# Altium project oai_kpa_mku.PrjPcb (part 1 of 2)
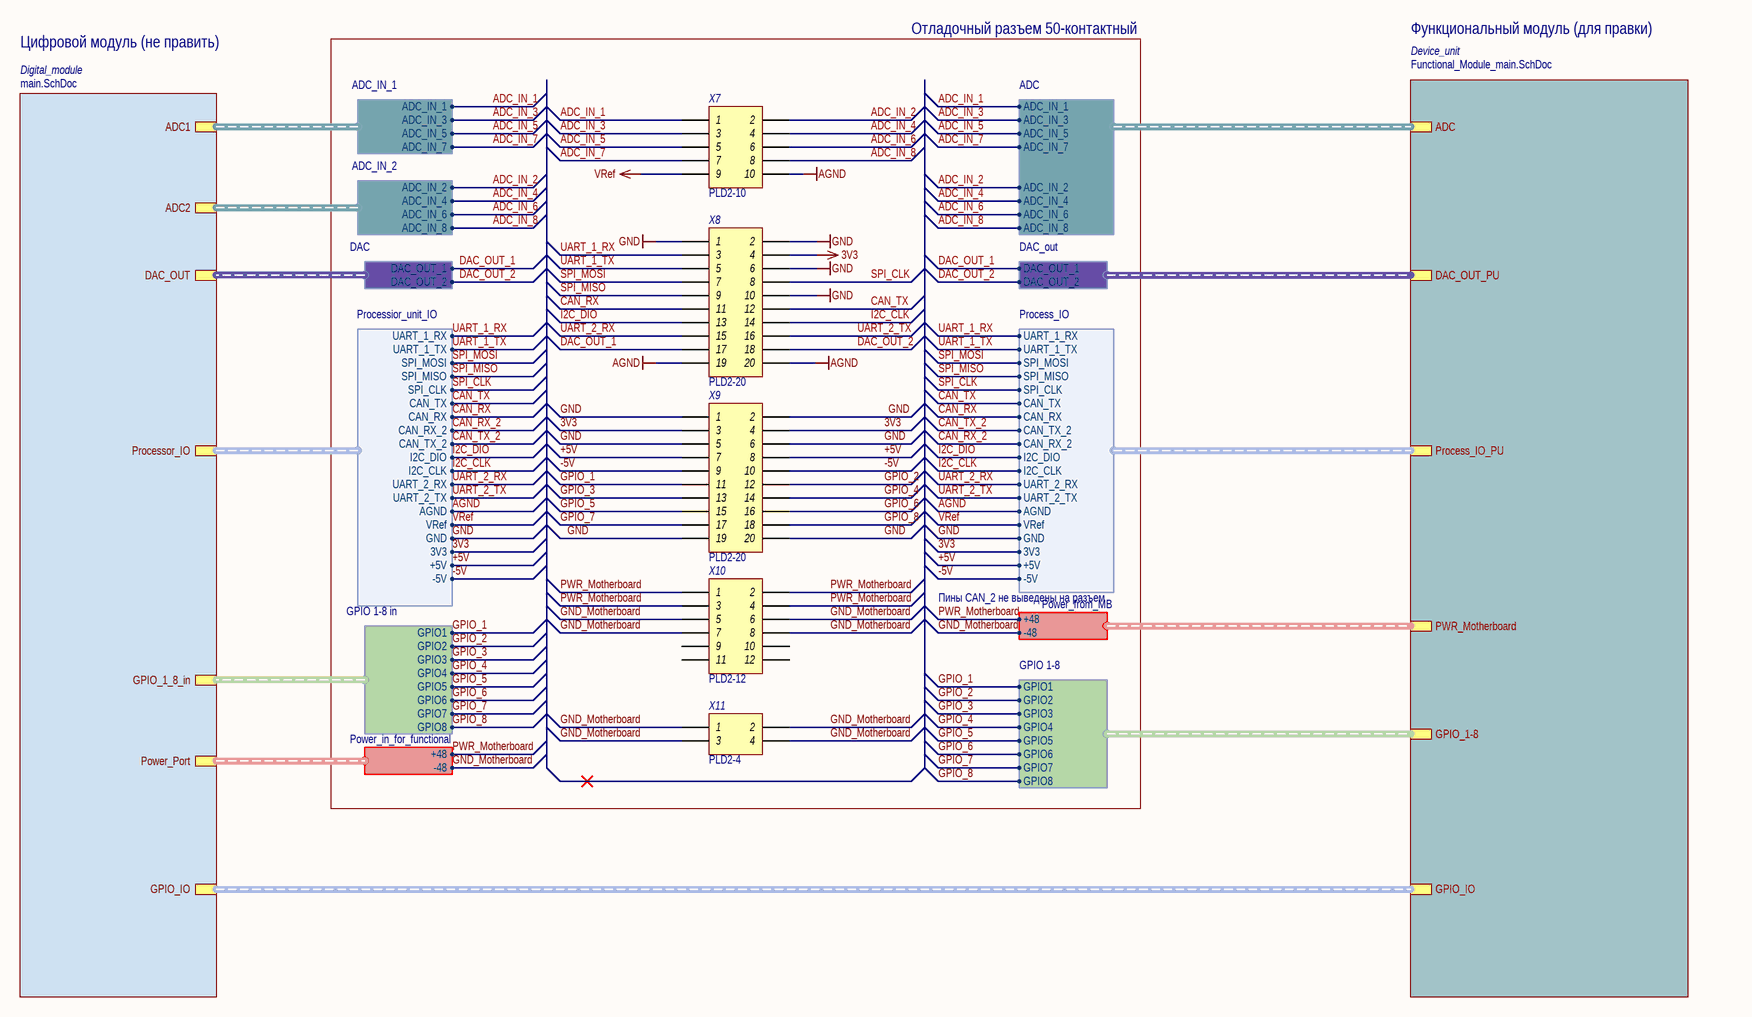
[diagram p0: Module_main.SchDoc]
GlobalFunctionalModuleName: ОАИ КПА УЦМ; GlobalFunctionalModuleRevision: #3.0; GlobalProjectName: OAI_KPA_MKU; GlobalProjectNumber: ЮМП.250.; GlobalProjectRevision: #2.2; Наименование: ОАИ КПА МКУ Модуль; Норм.Контр.: Задорожная; Проверил: Прокопьев; Разработал: Стюф; Утвердил: Прокопьев
10 sheets, 177 parts. Net scope: hierarchical (ports join the sheet entries above them; power ports are global).
Board file: oai_kpa_mku.PcbDoc
Sheets:
  Module_main.SchDoc
    Digital_module = main.SchDoc
      USB = USB.SchDoc
      ADC_Filter = adc.SchDoc
      DAC_Filter = dac.SchDoc
      Designator = GPIO_Shunt.SchDoc
      Power = power.SchDoc
    Device_unit = Functional_Module_main.SchDoc
      mku_0 = mku_16_ch.SchDoc
        opt_0 = optron_ku_2ch.SchDoc
        opt_1 = optron_ku_2ch.SchDoc
        opt_2 = optron_ku_2ch.SchDoc
        opt_3 = optron_ku_2ch.SchDoc
        opt_4 = optron_ku_2ch.SchDoc
        opt_5 = optron_ku_2ch.SchDoc
        opt_6 = optron_ku_2ch.SchDoc
        opt_7 = optron_ku_2ch.SchDoc

## Sheet Module_main.SchDoc: =GlobalProjectName
size 410 x 297 mm; ApprovedBy: Прокопьев; CheckedBy: Прокопьев; Author: Стюф; DocumentNumber: ЮМП.250. Э3; Revision: #2.2; SheetNumber: 7; SheetTotal: 9; PageSetup: Record=PageOptions|CenterHorizontal=True|CenterVertical=True|PrintScale=1.00|XCorrection=1.00|YCorrection=1.00|PrintKind=1|BorderSize=5000000|LeftOffset=0|BottomOffset=0|Orientation=2|PaperLength=1000|PaperWidth=1000|Scale=100|PaperSource=15|PrintQuality=1200|MediaType=1|DitherType=10|PaperKind=A3|PrintScaleMode=1; Weight: -; ScaleFactor: -; NormInspection: Задорожная; FirstApplication: ЮМП.250.; DocumentName: OAI_KPA_MKU

### Parts
X7  Header 2X10  [PBD2-10s]  (value not drawn)
X8  Header 2X10  [PBD2-20s]  (value not drawn)
X9  Header 2X10  [PBD2-20s]  (value not drawn)
X10  Header 2X6  [PLD2-12R 2.54]  (value not drawn)
X11  Header 2X4  [PLD2-4 R 2.54]  (value not drawn)

### Sub-sheets
Device_unit = Functional_Module_main.SchDoc: GPIO_1-8 (harness GPIO 1-8), Process_IO_PU (harness Process_IO), DAC_OUT_PU (harness DAC_out), ADC (harness ADC), PWR_Motherboard (harness Power_from_MB), GPIO_IO (harness GPIO)
Digital_module = main.SchDoc: ADC2 (harness ADC_IN_2), DAC_OUT (harness DAC), Processor_IO (harness Processior_unit_IO), ADC1 (harness ADC_IN_1), Power_Port (harness Power_in_for_functional), GPIO_IO (harness GPIO), GPIO_1_8_in (harness GPIO 1-8 in)

### Harnesses
ADC_IN_1: ADC_IN_1, ADC_IN_3, ADC_IN_7, ADC_IN_5
ADC_IN_2: ADC_IN_8, ADC_IN_6, ADC_IN_4, ADC_IN_2
Processior_unit_IO: UART_1_RX, UART_1_TX, SPI_MOSI, SPI_MISO, SPI_CLK, CAN_TX, CAN_RX, I2C_DIO, I2C_CLK, UART_2_RX, UART_2_TX, AGND, VRef, GND, 3V3, +5V, -5V, CAN_RX_2, CAN_TX_2
DAC: DAC_OUT_1, DAC_OUT_2
GPIO 1-8 in: GPIO1, GPIO2, GPIO3, GPIO4, GPIO5, GPIO6, GPIO7, GPIO8
Process_IO: UART_1_RX, UART_1_TX, SPI_MOSI, SPI_MISO, SPI_CLK, CAN_TX, CAN_RX, I2C_DIO, I2C_CLK, UART_2_RX, UART_2_TX, AGND, VRef, GND, 3V3, +5V, -5V, CAN_TX_2, CAN_RX_2
ADC: ADC_IN_1, ADC_IN_3, ADC_IN_7, ADC_IN_5, ADC_IN_2, ADC_IN_4, ADC_IN_6, ADC_IN_8
DAC_out: DAC_OUT_1, DAC_OUT_2
GPIO 1-8: GPIO1, GPIO2, GPIO3, GPIO4, GPIO5, GPIO6, GPIO7, GPIO8
Power_in_for_functional: +48, -48
Power_from_MB: -48, +48

### Nets
3V3: X8.4 X9.3 X9.4 ; sheet Digital_module/Processor_IO.3V3, sheet Device_unit/Process_IO_PU.3V3  [project net 3.3V]
+5V: X9.7 X9.8 ; sheet Digital_module/Processor_IO.+5V, sheet Device_unit/Process_IO_PU.+5V
-5V: X9.9 X9.10 ; sheet Digital_module/Processor_IO.-5V, sheet Device_unit/Process_IO_PU.-5V
AGND: X7.10 X8.19 X8.20 ; sheet Digital_module/Processor_IO.AGND, sheet Device_unit/Process_IO_PU.AGND  [project net A_GND]
GND: X8.1 X8.2 X8.6 X8.10 X9.1 X9.2 X9.5 X9.6 X9.19 X9.20 ; sheet Digital_module/Processor_IO.GND, sheet Device_unit/Process_IO_PU.GND
GND_Motherboard: X10.5 X10.6 X10.7 X10.8 X11.1 X11.2 X11.3 X11.4 ; sheet Digital_module/Power_Port.-48, sheet Device_unit/PWR_Motherboard.-48  [project net GND_IN]
PWR_Motherboard: X10.1 X10.2 X10.3 X10.4 ; sheet Digital_module/Power_Port.+48, sheet Device_unit/PWR_Motherboard.+48  [project net Power_IN]
VRef: X7.9 ; sheet Digital_module/Processor_IO.VRef, sheet Device_unit/Process_IO_PU.VRef  [project net 2V048]
ADC_IN_1: X7.1 ; sheet Digital_module/ADC1.ADC_IN_1, sheet Device_unit/ADC.ADC_IN_1
ADC_IN_2: X7.2 ; sheet Digital_module/ADC2.ADC_IN_2, sheet Device_unit/ADC.ADC_IN_2
ADC_IN_3: X7.3 ; sheet Digital_module/ADC1.ADC_IN_3, sheet Device_unit/ADC.ADC_IN_3
ADC_IN_4: X7.4 ; sheet Digital_module/ADC2.ADC_IN_4, sheet Device_unit/ADC.ADC_IN_4
ADC_IN_5: X7.5 ; sheet Digital_module/ADC1.ADC_IN_5, sheet Device_unit/ADC.ADC_IN_5
ADC_IN_6: X7.6 ; sheet Digital_module/ADC2.ADC_IN_6, sheet Device_unit/ADC.ADC_IN_6
ADC_IN_7: X7.7 ; sheet Digital_module/ADC1.ADC_IN_7, sheet Device_unit/ADC.ADC_IN_7
ADC_IN_8: X7.8 ; sheet Digital_module/ADC2.ADC_IN_8, sheet Device_unit/ADC.ADC_IN_8
CAN_RX: X8.11 ; sheet Digital_module/Processor_IO.CAN_RX, sheet Device_unit/Process_IO_PU.CAN_RX
CAN_RX_2: sheet Digital_module/Processor_IO.CAN_RX_2, sheet Device_unit/Process_IO_PU.CAN_RX_2
CAN_TX: X8.12 ; sheet Digital_module/Processor_IO.CAN_TX, sheet Device_unit/Process_IO_PU.CAN_TX
CAN_TX_2: sheet Digital_module/Processor_IO.CAN_TX_2, sheet Device_unit/Process_IO_PU.CAN_TX_2
DAC_OUT_1: X8.17 ; sheet Digital_module/DAC_OUT.DAC_OUT_1, sheet Device_unit/DAC_OUT_PU.DAC_OUT_1
DAC_OUT_2: X8.18 ; sheet Digital_module/DAC_OUT.DAC_OUT_2, sheet Device_unit/DAC_OUT_PU.DAC_OUT_2
GPIO_1: X9.11 ; sheet Digital_module/GPIO_1_8_in.GPIO1, sheet Device_unit/GPIO_1-8.GPIO1
GPIO_2: X9.12 ; sheet Digital_module/GPIO_1_8_in.GPIO2, sheet Device_unit/GPIO_1-8.GPIO2
GPIO_3: X9.13 ; sheet Digital_module/GPIO_1_8_in.GPIO3, sheet Device_unit/GPIO_1-8.GPIO3
GPIO_4: X9.14 ; sheet Digital_module/GPIO_1_8_in.GPIO4, sheet Device_unit/GPIO_1-8.GPIO4
GPIO_5: X9.15 ; sheet Digital_module/GPIO_1_8_in.GPIO5, sheet Device_unit/GPIO_1-8.GPIO5
GPIO_6: X9.16 ; sheet Digital_module/GPIO_1_8_in.GPIO6, sheet Device_unit/GPIO_1-8.GPIO6
GPIO_7: X9.17 ; sheet Digital_module/GPIO_1_8_in.GPIO7, sheet Device_unit/GPIO_1-8.GPIO7
GPIO_8: X9.18 ; sheet Digital_module/GPIO_1_8_in.GPIO8, sheet Device_unit/GPIO_1-8.GPIO8
I2C_CLK: X8.14 ; sheet Digital_module/Processor_IO.I2C_CLK, sheet Device_unit/Process_IO_PU.I2C_CLK
I2C_DIO: X8.13 ; sheet Digital_module/Processor_IO.I2C_DIO, sheet Device_unit/Process_IO_PU.I2C_DIO
SPI_CLK: X8.8 ; sheet Digital_module/Processor_IO.SPI_CLK, sheet Device_unit/Process_IO_PU.SPI_CLK
SPI_MISO: X8.9 ; sheet Digital_module/Processor_IO.SPI_MISO, sheet Device_unit/Process_IO_PU.SPI_MISO
SPI_MOSI: X8.7 ; sheet Digital_module/Processor_IO.SPI_MOSI, sheet Device_unit/Process_IO_PU.SPI_MOSI
UART_1_RX: X8.3 ; sheet Digital_module/Processor_IO.UART_1_RX, sheet Device_unit/Process_IO_PU.UART_1_RX
UART_1_TX: X8.5 ; sheet Digital_module/Processor_IO.UART_1_TX, sheet Device_unit/Process_IO_PU.UART_1_TX
UART_2_RX: X8.15 ; sheet Digital_module/Processor_IO.UART_2_RX, sheet Device_unit/Process_IO_PU.UART_2_RX
UART_2_TX: X8.16 ; sheet Digital_module/Processor_IO.UART_2_TX, sheet Device_unit/Process_IO_PU.UART_2_TX

Not connected (* = marked no-connect by the designer): X10 9 10 11 12

### Buses and harness runs
harness sheet Device_unit/GPIO_IO = sheet Digital_module/GPIO_IO

### Notes on the sheet
- Цифровой модуль (не править)
- Отладочный разъем 50-контактный
- Функциональный модуль (для правки)
- Пины CAN_2 не выведены на разъем
- Перв. примен.
- Справ. №
- Подп. и дата
- Инв. № дубл.
- Взам. инв. №
- Изм.
- Разраб.
- Лист
- № докум.
- Подп.
- Дата
- Литера
- Масса
- Масштаб
- Пров.
- Т.контр.
- Листов
- Н.контр.
- Утв.
- Инв. № подл.
- Форма 1 ГОСТ 2.104-2006
- Копировал
- Формат А3

### Library data of the parts
X7 = PLD2-10: Header, 10-Pin, Dual row; Потребление, Вт: 0,0; Назначение: Header, 10-Pin, Dual row; Наименование: PLD2-10
X8 X9 = PLD2-20: Header, 12-Pin, Dual row; Назначение: Header, 20-Pin, Dual row; Потребление, Вт: 0,0; Наименование: PLD2-20
X10 = PLD2-12: Header, 12-Pin, Dual row; Потребление, Вт: 0,0; Назначение: Header, 12-Pin, Dual row; Наименование: PLD2-12
X11 = PLD2-4: Header, 4-Pin, Dual row; Потребление, Вт: 0,0; Назначение: Header, 4-Pin, Dual row; Наименование: PLD2-4

## Sheet main.SchDoc: =GlobalProjectName
size 410 x 297 mm; ApprovedBy: Утвердил; CheckedBy: Проверил; Author: Разработал; DocumentNumber: ЮМП.250. Э3; Revision: #2.2; SheetNumber: 3; SheetTotal: 9; PageSetup: Record=PageOptions|CenterHorizontal=True|CenterVertical=True|PrintScale=1.00|XCorrection=1.00|YCorrection=1.00|PrintKind=1|BorderSize=5000000|LeftOffset=0|BottomOffset=0|Orientation=2|PaperLength=1000|PaperWidth=1000|Scale=100|PaperSource=15|PrintQuality=1200|MediaType=1|DitherType=10|PaperKind=A3|PrintScaleMode=1; Weight: -; ScaleFactor: -; NormInspection: Норм.Контр.; FirstApplication: ЮМП.250.; Time: Листов; DocumentName: OAI_KPA_MKU
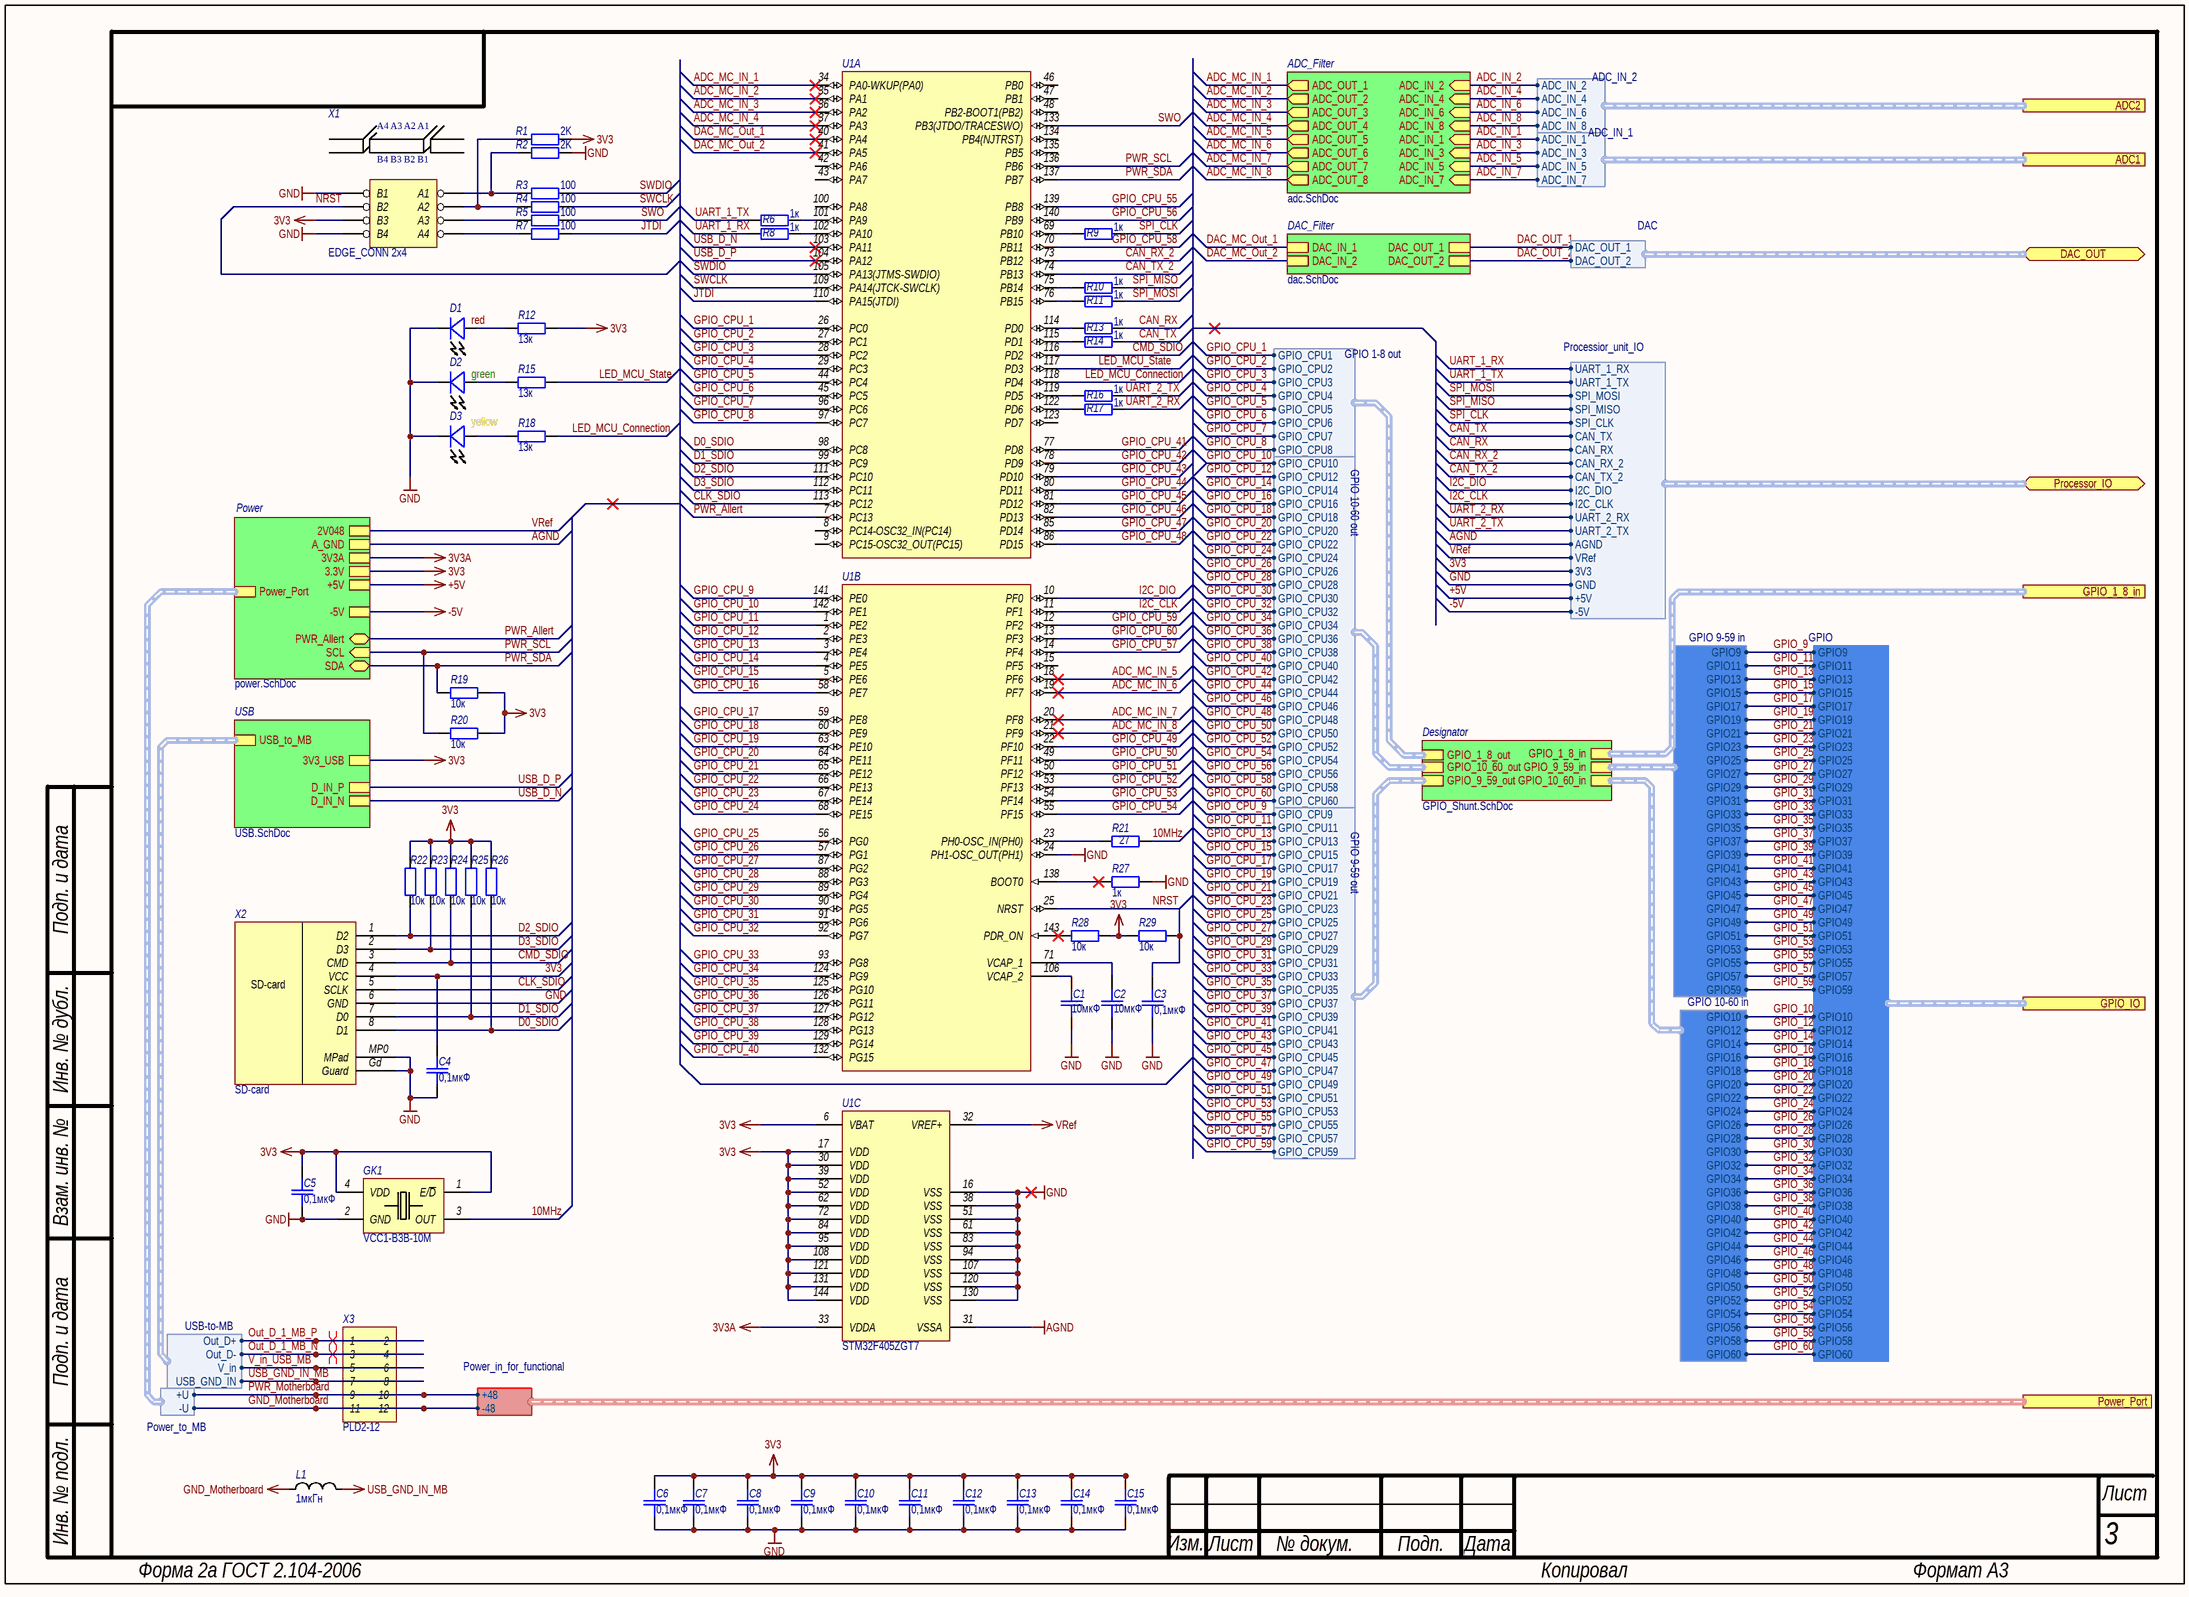
[diagram p1: main.SchDoc]

### Parts
C1  10мкФ  [SMD_0805]
C2  10мкФ  [SMD_0805]
C3  0,1мкФ  [SMD_0805]
C4  0,1мкФ  [SMD_0805]
C5  0,1мкФ  [SMD_0805]
C6  0,1мкФ  [SMD_0805]
C7  0,1мкФ  [SMD_0805]
C8  0,1мкФ  [SMD_0805]
C9  0,1мкФ  [SMD_0805]
C10  0,1мкФ  [SMD_0805]
C11  0,1мкФ  [SMD_0805]
C12  0,1мкФ  [SMD_0805]
C13  0,1мкФ  [SMD_0805]
C14  0,1мкФ  [SMD_0805]
C15  0,1мкФ  [SMD_0805]
D1  value red  [LED-0805]  (hidden comment: LED)
D2  value green  [LED-0805]  (hidden comment: LED)
D3  value yellow  [LED-0805]  (hidden comment: LED)
GK1  Наименование: VCC1-B3B-10M  [SMD_7050_Crystal_Oscillator]  (hidden comment: GK108-P)
L1  1мкГн  [SMD_0805]
R1  2K  [SMD_0603]
R2  2K  [SMD_0603]
R3  100  [SMD_0603]
R4  100  [SMD_0603]
R5  100  [SMD_0603]
R6  1к  [SMD_0603]
R7  100  [SMD_0603]
R8  1к  [SMD_0603]
R9  1к  [SMD_0603]
R10  1к  [SMD_0603]
R11  1к  [SMD_0603]
R12  13к  [SMD_0603]
R13  1к  [SMD_0603]
R14  1к  [SMD_0603]
R15  13к  [SMD_0603]
R16  1к  [SMD_0603]
R17  1к  [SMD_0603]
R18  13к  [SMD_0603]
R19  10к  [SMD_0603]
R20  10к  [SMD_0603]
R21  27  [SMD_0603]
R22  10к  [SMD_0603]
R23  10к  [SMD_0603]
R24  10к  [SMD_0603]
R25  10к  [SMD_0603]
R26  10к  [SMD_0603]
R27  1к  [SMD_0603]
R28  10к  [SMD_0603]
R29  10к  [SMD_0603]
U1  STM32F405ZGT7  [LQFP144]  (value not drawn)  (parts A,B,C of 3)
X1  EDGE_CONN 2x4  [EDGE_CON-8]
X2  SD-card  [SD-card holder]
X3  Header 2X6  [PLD2-12R 2.54]  (value not drawn)

### Sub-sheets
ADC_Filter = adc.SchDoc: ADC_OUT_4 (out), ADC_IN_7 (in), ADC_OUT_3 (out), ADC_IN_4 (in), ADC_IN_2 (in), ADC_IN_3 (in), ADC_IN_1 (in), ADC_IN_8 (in), ADC_IN_5 (in), ADC_OUT_7 (out), ADC_OUT_1 (out), ADC_OUT_6 (out), ADC_IN_6 (in), ADC_OUT_5 (out), ADC_OUT_2 (out), ADC_OUT_8 (out)
DAC_Filter = dac.SchDoc: DAC_IN_1, DAC_OUT_1, DAC_IN_2, DAC_OUT_2
Designator = GPIO_Shunt.SchDoc: GPIO_10_60_out (harness GPIO 10-60 out), GPIO_10_60_in (harness GPIO 10-60 in), GPIO_9_59_out (harness GPIO 9-59 out), GPIO_9_59_in (harness GPIO 9-59 in), GPIO_1_8_out (harness GPIO 1-8 out), GPIO_1_8_in (harness GPIO 1-8 in)
Power = power.SchDoc: 3.3V, PWR_Allert (bidir), +5V, SCL (in), SDA (bidir), -5V, 2V048, A_GND, Power_Port (harness Power_to_MB), 3V3A
USB = USB.SchDoc: USB_to_MB (harness USB-to-MB), 3V3_USB, D_IN_P, D_IN_N

### Ports
ADC1 (harness ADC_IN_1), ADC2 (harness ADC_IN_2), DAC_OUT (bidir, harness DAC), GPIO_1_8_in (harness GPIO 10-60 in), GPIO_IO (harness GPIO), Power_Port (harness Power_in_for_functional), Processor_IO (bidir, harness Processior_unit_IO)

### Harnesses
ADC_IN_2: ADC_IN_2, ADC_IN_4, ADC_IN_6, ADC_IN_8
ADC_IN_1: ADC_IN_3, ADC_IN_1, ADC_IN_5, ADC_IN_7
GPIO 1-8 out: GPIO_CPU2, GPIO_CPU3, GPIO_CPU4, GPIO_CPU5, GPIO_CPU6, GPIO_CPU7, GPIO_CPU8, GPIO_CPU1
GPIO 10-60 out: GPIO_CPU12, GPIO_CPU10, GPIO_CPU14, GPIO_CPU16, GPIO_CPU18, GPIO_CPU20, GPIO_CPU22, GPIO_CPU24, GPIO_CPU26, GPIO_CPU28, GPIO_CPU30, GPIO_CPU32, GPIO_CPU34, GPIO_CPU36, GPIO_CPU38, GPIO_CPU40, GPIO_CPU42, GPIO_CPU44, GPIO_CPU46, GPIO_CPU48, GPIO_CPU50, GPIO_CPU52, GPIO_CPU54, GPIO_CPU56, GPIO_CPU58, GPIO_CPU60
GPIO 9-59 out: GPIO_CPU13, GPIO_CPU11, GPIO_CPU15, GPIO_CPU17, GPIO_CPU19, GPIO_CPU21, GPIO_CPU23, GPIO_CPU25, GPIO_CPU27, GPIO_CPU29, GPIO_CPU31, GPIO_CPU33, GPIO_CPU35, GPIO_CPU37, GPIO_CPU39, GPIO_CPU41, GPIO_CPU43, GPIO_CPU45, GPIO_CPU47, GPIO_CPU49, GPIO_CPU51, GPIO_CPU53, GPIO_CPU55, GPIO_CPU57, GPIO_CPU59, GPIO_CPU9
Power_to_MB: +U, -U
USB-to-MB: V_in, Out_D+, Out_D-, USB_GND_IN
DAC: DAC_OUT_1, DAC_OUT_2
Processior_unit_IO: UART_1_RX, UART_1_TX, SPI_MOSI, SPI_MISO, SPI_CLK, CAN_TX, CAN_RX, I2C_DIO, I2C_CLK, UART_2_RX, UART_2_TX, AGND, VRef, 3V3, GND, +5V, -5V, CAN_RX_2, CAN_TX_2
Power_in_for_functional: +48, -48
GPIO 9-59 in: GPIO9, GPIO11, GPIO13, GPIO15, GPIO17, GPIO19, GPIO21, GPIO23, GPIO25, GPIO27, GPIO29, GPIO31, GPIO33, GPIO35, GPIO37, GPIO39, GPIO41, GPIO43, GPIO45, GPIO47, GPIO49, GPIO51, GPIO53, GPIO55, GPIO57, GPIO59
GPIO 10-60 in: GPIO10, GPIO12, GPIO14, GPIO16, GPIO18, GPIO20, GPIO22, GPIO24, GPIO26, GPIO28, GPIO30, GPIO32, GPIO34, GPIO36, GPIO38, GPIO40, GPIO42, GPIO44, GPIO46, GPIO48, GPIO50, GPIO52, GPIO54, GPIO56, GPIO58, GPIO60
GPIO: GPIO9, GPIO11, GPIO13, GPIO15, GPIO17, GPIO19, GPIO21, GPIO23, GPIO25, GPIO27, GPIO29, GPIO31, GPIO33, GPIO35, GPIO37, GPIO39, GPIO41, GPIO43, GPIO45, GPIO47, GPIO49, GPIO51, GPIO53, GPIO55, GPIO57, GPIO59, GPIO10, GPIO12, GPIO14, GPIO16, GPIO18, GPIO20, GPIO22, GPIO24, GPIO26, GPIO28, GPIO30, GPIO32, GPIO34, GPIO36, GPIO38, GPIO40, GPIO42, GPIO44, GPIO46, GPIO48, GPIO50, GPIO52, GPIO54, GPIO56, GPIO58, GPIO60

### Nets
3V3: C4.2 C5.2 C6.2 C7.2 C8.2 C9.2 C10.2 C11.2 C12.2 C13.2 C14.2 C15.2 GK1.1(E/~{D}) GK1.4(VDD) R1.2 R12.2 R19.2 R20.2 R22.2 R23.2 R24.2 R25.2 R26.2 R28.2 R29.1 U1.6(VBAT) U1.17(VDD) U1.30(VDD) U1.39(VDD) U1.52(VDD) U1.62(VDD) U1.72(VDD) U1.84(VDD) U1.95(VDD) U1.108(VDD) U1.121(VDD) U1.131(VDD) U1.144(VDD) X1.B3 X2.4(VCC) ; sheet USB/3V3_USB, sheet Power/3.3V, port Processor_IO.3V3  [project net 3.3V]
3V3A: U1.33(VDDA) ; sheet Power/3V3A
+5V: sheet Power/+5V, port Processor_IO.+5V
-5V: sheet Power/-5V, port Processor_IO.-5V
AGND: U1.31(VSSA) ; sheet Power/A_GND, port Processor_IO.AGND  [project net A_GND]
GND: C1.1 C2.1 C3.1 C4.1 C5.1 C6.1 C7.1 C8.1 C9.1 C10.1 C11.1 C12.1 C13.1 C14.1 C15.1 D1.2(K) D2.2(K) D3.2(K) GK1.2(GND) R2.2 R27.2 U1.16(VSS) U1.24(PH1-OSC_OUT(PH1)) U1.38(VSS) U1.51(VSS) U1.61(VSS) U1.83(VSS) U1.94(VSS) U1.107(VSS) U1.120(VSS) U1.130(VSS) X1.B1 X1.B4 X2.6(GND) X2.Gd(Guard) X2.MP0(MPad) ; port Processor_IO.GND
GND_Motherboard: L1.1 X3.11 X3.12 ; sheet Power/Power_Port.-U, port Power_Port.-48  [project net GND_IN]
PWR_Motherboard: X3.9 X3.10 ; sheet Power/Power_Port.+U, port Power_Port.+48  [project net Power_IN]
USB_GND_IN_MB: L1.2 X3.7 X3.8 ; sheet USB/USB_to_MB.USB_GND_IN  [project net USB_GND_IN]
VRef: U1.32(VREF+) ; sheet Power/2V048, port Processor_IO.VRef  [project net 2V048]
10MHz: GK1.3(OUT) R21.2
ADC_IN_1: sheet ADC_Filter/ADC_IN_1, port ADC1.ADC_IN_1
ADC_IN_2: sheet ADC_Filter/ADC_IN_2, port ADC2.ADC_IN_2
ADC_IN_3: sheet ADC_Filter/ADC_IN_3, port ADC1.ADC_IN_3
ADC_IN_4: sheet ADC_Filter/ADC_IN_4, port ADC2.ADC_IN_4
ADC_IN_5: sheet ADC_Filter/ADC_IN_5, port ADC1.ADC_IN_5
ADC_IN_6: sheet ADC_Filter/ADC_IN_6, port ADC2.ADC_IN_6
ADC_IN_7: sheet ADC_Filter/ADC_IN_7, port ADC1.ADC_IN_7
ADC_IN_8: sheet ADC_Filter/ADC_IN_8, port ADC2.ADC_IN_8
ADC_MC_IN_1: U1.34(PA0-WKUP(PA0)) ; sheet ADC_Filter/ADC_OUT_1
ADC_MC_IN_2: U1.35(PA1) ; sheet ADC_Filter/ADC_OUT_2
ADC_MC_IN_3: U1.36(PA2) ; sheet ADC_Filter/ADC_OUT_3
ADC_MC_IN_4: U1.37(PA3) ; sheet ADC_Filter/ADC_OUT_4
ADC_MC_IN_5: U1.18(PF6) ; sheet ADC_Filter/ADC_OUT_5
ADC_MC_IN_6: U1.19(PF7) ; sheet ADC_Filter/ADC_OUT_6
ADC_MC_IN_7: U1.20(PF8) ; sheet ADC_Filter/ADC_OUT_7
ADC_MC_IN_8: U1.21(PF9) ; sheet ADC_Filter/ADC_OUT_8
CAN_RX: R13.2 ; port Processor_IO.CAN_RX
CAN_RX_2: U1.73(PB12) ; port Processor_IO.CAN_RX_2
CAN_TX: R14.2 ; port Processor_IO.CAN_TX
CAN_TX_2: U1.74(PB13) ; port Processor_IO.CAN_TX_2
CLK_SDIO: U1.113(PC12) X2.5(SCLK)
CMD_SDIO: R24.1 U1.116(PD2) X2.3(CMD)
D0_SDIO: R26.1 U1.98(PC8) X2.8(D1)
D1_SDIO: R25.1 U1.99(PC9) X2.7(D0)
D2_SDIO: R22.1 U1.111(PC10) X2.1(D2)
D3_SDIO: R23.1 U1.112(PC11) X2.2(D3)
DAC_MC_Out_1: U1.40(PA4) ; sheet DAC_Filter/DAC_IN_1
DAC_MC_Out_2: U1.41(PA5) ; sheet DAC_Filter/DAC_IN_2
DAC_OUT_1: sheet DAC_Filter/DAC_OUT_1, port DAC_OUT.DAC_OUT_1
DAC_OUT_2: sheet DAC_Filter/DAC_OUT_2, port DAC_OUT.DAC_OUT_2
GPIO_9: U1.141(PE0) ; sheet Designator/GPIO_9_59_out.GPIO_CPU9, sheet Designator/GPIO_9_59_in.GPIO9, port GPIO_IO.GPIO9  [also labelled GPIO_CPU_9]
GPIO_10: U1.142(PE1) ; sheet Designator/GPIO_10_60_out.GPIO_CPU10, sheet Designator/GPIO_10_60_in.GPIO10, port GPIO_IO.GPIO10  [also labelled GPIO_CPU_10]
GPIO_11: U1.1(PE2) ; sheet Designator/GPIO_9_59_out.GPIO_CPU11, sheet Designator/GPIO_9_59_in.GPIO11, port GPIO_IO.GPIO11  [also labelled GPIO_CPU_11]
GPIO_12: U1.2(PE3) ; sheet Designator/GPIO_10_60_out.GPIO_CPU12, sheet Designator/GPIO_10_60_in.GPIO12, port GPIO_IO.GPIO12  [also labelled GPIO_CPU_12]
GPIO_13: U1.3(PE4) ; sheet Designator/GPIO_9_59_out.GPIO_CPU13, sheet Designator/GPIO_9_59_in.GPIO13, port GPIO_IO.GPIO13  [also labelled GPIO_CPU_13]
GPIO_14: U1.4(PE5) ; sheet Designator/GPIO_10_60_out.GPIO_CPU14, sheet Designator/GPIO_10_60_in.GPIO14, port GPIO_IO.GPIO14  [also labelled GPIO_CPU_14]
GPIO_15: U1.5(PE6) ; sheet Designator/GPIO_9_59_out.GPIO_CPU15, sheet Designator/GPIO_9_59_in.GPIO15, port GPIO_IO.GPIO15  [also labelled GPIO_CPU_15]
GPIO_16: U1.58(PE7) ; sheet Designator/GPIO_10_60_out.GPIO_CPU16, sheet Designator/GPIO_10_60_in.GPIO16, port GPIO_IO.GPIO16  [also labelled GPIO_CPU_16]
GPIO_17: U1.59(PE8) ; sheet Designator/GPIO_9_59_out.GPIO_CPU17, sheet Designator/GPIO_9_59_in.GPIO17, port GPIO_IO.GPIO17  [also labelled GPIO_CPU_17]
GPIO_18: U1.60(PE9) ; sheet Designator/GPIO_10_60_out.GPIO_CPU18, sheet Designator/GPIO_10_60_in.GPIO18, port GPIO_IO.GPIO18  [also labelled GPIO_CPU_18]
GPIO_19: U1.63(PE10) ; sheet Designator/GPIO_9_59_out.GPIO_CPU19, sheet Designator/GPIO_9_59_in.GPIO19, port GPIO_IO.GPIO19  [also labelled GPIO_CPU_19]
GPIO_20: U1.64(PE11) ; sheet Designator/GPIO_10_60_out.GPIO_CPU20, sheet Designator/GPIO_10_60_in.GPIO20, port GPIO_IO.GPIO20  [also labelled GPIO_CPU_20]
GPIO_21: U1.65(PE12) ; sheet Designator/GPIO_9_59_out.GPIO_CPU21, sheet Designator/GPIO_9_59_in.GPIO21, port GPIO_IO.GPIO21  [also labelled GPIO_CPU_21]
GPIO_22: U1.66(PE13) ; sheet Designator/GPIO_10_60_out.GPIO_CPU22, sheet Designator/GPIO_10_60_in.GPIO22, port GPIO_IO.GPIO22  [also labelled GPIO_CPU_22]
GPIO_23: U1.67(PE14) ; sheet Designator/GPIO_9_59_out.GPIO_CPU23, sheet Designator/GPIO_9_59_in.GPIO23, port GPIO_IO.GPIO23  [also labelled GPIO_CPU_23]
GPIO_24: U1.68(PE15) ; sheet Designator/GPIO_10_60_out.GPIO_CPU24, sheet Designator/GPIO_10_60_in.GPIO24, port GPIO_IO.GPIO24  [also labelled GPIO_CPU_24]
GPIO_25: U1.56(PG0) ; sheet Designator/GPIO_9_59_out.GPIO_CPU25, sheet Designator/GPIO_9_59_in.GPIO25, port GPIO_IO.GPIO25  [also labelled GPIO_CPU_25]
GPIO_26: U1.57(PG1) ; sheet Designator/GPIO_10_60_out.GPIO_CPU26, sheet Designator/GPIO_10_60_in.GPIO26, port GPIO_IO.GPIO26  [also labelled GPIO_CPU_26]
GPIO_27: U1.87(PG2) ; sheet Designator/GPIO_9_59_out.GPIO_CPU27, sheet Designator/GPIO_9_59_in.GPIO27, port GPIO_IO.GPIO27  [also labelled GPIO_CPU_27]
GPIO_28: U1.88(PG3) ; sheet Designator/GPIO_10_60_out.GPIO_CPU28, sheet Designator/GPIO_10_60_in.GPIO28, port GPIO_IO.GPIO28  [also labelled GPIO_CPU_28]
GPIO_29: U1.89(PG4) ; sheet Designator/GPIO_9_59_out.GPIO_CPU29, sheet Designator/GPIO_9_59_in.GPIO29, port GPIO_IO.GPIO29  [also labelled GPIO_CPU_29]
GPIO_30: U1.90(PG5) ; sheet Designator/GPIO_10_60_out.GPIO_CPU30, sheet Designator/GPIO_10_60_in.GPIO30, port GPIO_IO.GPIO30  [also labelled GPIO_CPU_30]
GPIO_31: U1.91(PG6) ; sheet Designator/GPIO_9_59_out.GPIO_CPU31, sheet Designator/GPIO_9_59_in.GPIO31, port GPIO_IO.GPIO31  [also labelled GPIO_CPU_31]
GPIO_32: U1.92(PG7) ; sheet Designator/GPIO_10_60_out.GPIO_CPU32, sheet Designator/GPIO_10_60_in.GPIO32, port GPIO_IO.GPIO32  [also labelled GPIO_CPU_32]
GPIO_33: U1.93(PG8) ; sheet Designator/GPIO_9_59_out.GPIO_CPU33, sheet Designator/GPIO_9_59_in.GPIO33, port GPIO_IO.GPIO33  [also labelled GPIO_CPU_33]
GPIO_34: U1.124(PG9) ; sheet Designator/GPIO_10_60_out.GPIO_CPU34, sheet Designator/GPIO_10_60_in.GPIO34, port GPIO_IO.GPIO34  [also labelled GPIO_CPU_34]
GPIO_35: U1.125(PG10) ; sheet Designator/GPIO_9_59_out.GPIO_CPU35, sheet Designator/GPIO_9_59_in.GPIO35, port GPIO_IO.GPIO35  [also labelled GPIO_CPU_35]
GPIO_36: U1.126(PG11) ; sheet Designator/GPIO_10_60_out.GPIO_CPU36, sheet Designator/GPIO_10_60_in.GPIO36, port GPIO_IO.GPIO36  [also labelled GPIO_CPU_36]
GPIO_37: U1.127(PG12) ; sheet Designator/GPIO_9_59_out.GPIO_CPU37, sheet Designator/GPIO_9_59_in.GPIO37, port GPIO_IO.GPIO37  [also labelled GPIO_CPU_37]
GPIO_38: U1.128(PG13) ; sheet Designator/GPIO_10_60_out.GPIO_CPU38, sheet Designator/GPIO_10_60_in.GPIO38, port GPIO_IO.GPIO38  [also labelled GPIO_CPU_38]
GPIO_39: U1.129(PG14) ; sheet Designator/GPIO_9_59_out.GPIO_CPU39, sheet Designator/GPIO_9_59_in.GPIO39, port GPIO_IO.GPIO39  [also labelled GPIO_CPU_39]
GPIO_40: U1.132(PG15) ; sheet Designator/GPIO_10_60_out.GPIO_CPU40, sheet Designator/GPIO_10_60_in.GPIO40, port GPIO_IO.GPIO40  [also labelled GPIO_CPU_40]
GPIO_41: U1.77(PD8) ; sheet Designator/GPIO_9_59_out.GPIO_CPU41, sheet Designator/GPIO_9_59_in.GPIO41, port GPIO_IO.GPIO41  [also labelled GPIO_CPU_41]
GPIO_42: U1.78(PD9) ; sheet Designator/GPIO_10_60_out.GPIO_CPU42, sheet Designator/GPIO_10_60_in.GPIO42, port GPIO_IO.GPIO42  [also labelled GPIO_CPU_42]
GPIO_43: U1.79(PD10) ; sheet Designator/GPIO_9_59_out.GPIO_CPU43, sheet Designator/GPIO_9_59_in.GPIO43, port GPIO_IO.GPIO43  [also labelled GPIO_CPU_43]
GPIO_44: U1.80(PD11) ; sheet Designator/GPIO_10_60_out.GPIO_CPU44, sheet Designator/GPIO_10_60_in.GPIO44, port GPIO_IO.GPIO44  [also labelled GPIO_CPU_44]
GPIO_45: U1.81(PD12) ; sheet Designator/GPIO_9_59_out.GPIO_CPU45, sheet Designator/GPIO_9_59_in.GPIO45, port GPIO_IO.GPIO45  [also labelled GPIO_CPU_45]
GPIO_46: U1.82(PD13) ; sheet Designator/GPIO_10_60_out.GPIO_CPU46, sheet Designator/GPIO_10_60_in.GPIO46, port GPIO_IO.GPIO46  [also labelled GPIO_CPU_46]
GPIO_47: U1.85(PD14) ; sheet Designator/GPIO_9_59_out.GPIO_CPU47, sheet Designator/GPIO_9_59_in.GPIO47, port GPIO_IO.GPIO47  [also labelled GPIO_CPU_47]
GPIO_48: U1.86(PD15) ; sheet Designator/GPIO_10_60_out.GPIO_CPU48, sheet Designator/GPIO_10_60_in.GPIO48, port GPIO_IO.GPIO48  [also labelled GPIO_CPU_48]
GPIO_49: U1.22(PF10) ; sheet Designator/GPIO_9_59_out.GPIO_CPU49, sheet Designator/GPIO_9_59_in.GPIO49, port GPIO_IO.GPIO49  [also labelled GPIO_CPU_49]
GPIO_50: U1.49(PF11) ; sheet Designator/GPIO_10_60_out.GPIO_CPU50, sheet Designator/GPIO_10_60_in.GPIO50, port GPIO_IO.GPIO50  [also labelled GPIO_CPU_50]
GPIO_51: U1.50(PF12) ; sheet Designator/GPIO_9_59_out.GPIO_CPU51, sheet Designator/GPIO_9_59_in.GPIO51, port GPIO_IO.GPIO51  [also labelled GPIO_CPU_51]
GPIO_52: U1.53(PF13) ; sheet Designator/GPIO_10_60_out.GPIO_CPU52, sheet Designator/GPIO_10_60_in.GPIO52, port GPIO_IO.GPIO52  [also labelled GPIO_CPU_52]
GPIO_53: U1.54(PF14) ; sheet Designator/GPIO_9_59_out.GPIO_CPU53, sheet Designator/GPIO_9_59_in.GPIO53, port GPIO_IO.GPIO53  [also labelled GPIO_CPU_53]
GPIO_54: U1.55(PF15) ; sheet Designator/GPIO_10_60_out.GPIO_CPU54, sheet Designator/GPIO_10_60_in.GPIO54, port GPIO_IO.GPIO54  [also labelled GPIO_CPU_54]
GPIO_55: U1.139(PB8) ; sheet Designator/GPIO_9_59_out.GPIO_CPU55, sheet Designator/GPIO_9_59_in.GPIO55, port GPIO_IO.GPIO55  [also labelled GPIO_CPU_55]
GPIO_56: U1.140(PB9) ; sheet Designator/GPIO_10_60_out.GPIO_CPU56, sheet Designator/GPIO_10_60_in.GPIO56, port GPIO_IO.GPIO56  [also labelled GPIO_CPU_56]
GPIO_57: U1.14(PF4) ; sheet Designator/GPIO_9_59_out.GPIO_CPU57, sheet Designator/GPIO_9_59_in.GPIO57, port GPIO_IO.GPIO57  [also labelled GPIO_CPU_57]
GPIO_58: U1.70(PB11) ; sheet Designator/GPIO_10_60_out.GPIO_CPU58, sheet Designator/GPIO_10_60_in.GPIO58, port GPIO_IO.GPIO58  [also labelled GPIO_CPU_58]
GPIO_59: U1.12(PF2) ; sheet Designator/GPIO_9_59_out.GPIO_CPU59, sheet Designator/GPIO_9_59_in.GPIO59, port GPIO_IO.GPIO59  [also labelled GPIO_CPU_59]
GPIO_60: U1.13(PF3) ; sheet Designator/GPIO_10_60_out.GPIO_CPU60, sheet Designator/GPIO_10_60_in.GPIO60, port GPIO_IO.GPIO60  [also labelled GPIO_CPU_60]
GPIO_CPU_1: U1.26(PC0) ; sheet Designator/GPIO_1_8_out.GPIO_CPU1
GPIO_CPU_2: U1.27(PC1) ; sheet Designator/GPIO_1_8_out.GPIO_CPU2
GPIO_CPU_3: U1.28(PC2) ; sheet Designator/GPIO_1_8_out.GPIO_CPU3
GPIO_CPU_4: U1.29(PC3) ; sheet Designator/GPIO_1_8_out.GPIO_CPU4
GPIO_CPU_5: U1.44(PC4) ; sheet Designator/GPIO_1_8_out.GPIO_CPU5
GPIO_CPU_6: U1.45(PC5) ; sheet Designator/GPIO_1_8_out.GPIO_CPU6
GPIO_CPU_7: U1.96(PC6) ; sheet Designator/GPIO_1_8_out.GPIO_CPU7
GPIO_CPU_8: U1.97(PC7) ; sheet Designator/GPIO_1_8_out.GPIO_CPU8
I2C_CLK: U1.11(PF1) ; port Processor_IO.I2C_CLK
I2C_DIO: U1.10(PF0) ; port Processor_IO.I2C_DIO
JTDI: R7.2 U1.110(PA15(JTDI))
LED_MCU_Connection: R18.2 U1.118(PD4)
LED_MCU_State: R15.2 U1.117(PD3)
NRST: C3.2 R29.2 U1.25(NRST) X1.B2
Out_D_1_MB_N: X3.3 X3.4 ; sheet USB/USB_to_MB.Out_D-
Out_D_1_MB_P: X3.1 X3.2 ; sheet USB/USB_to_MB.Out_D+
PWR_Allert: U1.7(PC13) ; sheet Power/PWR_Allert  [project net PWR_ALERT]
PWR_SCL: R20.1 U1.136(PB6) ; sheet Power/SCL  [project net I2C_SCL]
PWR_SDA: R19.1 U1.137(PB7) ; sheet Power/SDA  [project net I2C_SDA]
SPI_CLK: R9.2 ; port Processor_IO.SPI_CLK
SPI_MISO: R10.2 ; port Processor_IO.SPI_MISO
SPI_MOSI: R11.2 ; port Processor_IO.SPI_MOSI
SWCLK: R4.2 U1.109(PA14(JTCK-SWCLK))
SWDIO: R3.2 U1.105(PA13(JTMS-SWDIO))
SWO: R5.2 U1.133(PB3(JTDO/TRACESWO))
UART_1_RX: R8.1 ; port Processor_IO.UART_1_RX
UART_1_TX: R6.1 ; port Processor_IO.UART_1_TX
UART_2_RX: R17.2 ; port Processor_IO.UART_2_RX
UART_2_TX: R16.2 ; port Processor_IO.UART_2_TX
USB_D_N: U1.103(PA11) ; sheet USB/D_IN_N  [project net D_IN_3_N]
USB_D_P: U1.104(PA12) ; sheet USB/D_IN_P  [project net D_IN_3_P]
V_in_USB_MB: X3.5 X3.6 ; sheet USB/USB_to_MB.V_in  [project net V_in]
NetC1_2: C1.2 U1.106(VCAP_2)
NetC2_2: C2.2 U1.71(VCAP_1)
NetD1_1: D1.1(A) R12.1
NetD2_1: D2.1(A) R15.1
NetD3_1: D3.1(A) R18.1
NetR1_1: R1.1 R4.1 X1.A2
NetR2_1: R2.1 R3.1 X1.A1
NetR5_1: R5.1 X1.A3
NetR6_2: R6.2 U1.101(PA9)
NetR7_1: R7.1 X1.A4
NetR8_2: R8.2 U1.102(PA10)
NetR9_1: R9.1 U1.69(PB10)
NetR10_1: R10.1 U1.75(PB14)
NetR11_1: R11.1 U1.76(PB15)
NetR13_1: R13.1 U1.114(PD0)
NetR14_1: R14.1 U1.115(PD1)
NetR16_1: R16.1 U1.119(PD5)
NetR17_1: R17.1 U1.122(PD6)
NetR21_1: R21.1 U1.23(PH0-OSC_IN(PH0))
NetR27_1: R27.1 U1.138(BOOT0)
NetR28_1: R28.1 U1.143(PDR_ON)

Not connected (* = marked no-connect by the designer): U1 8(PC14-OSC32_IN(PC14)) 9(PC15-OSC32_OUT(PC15)) 15(PF5) 42(PA6) 43(PA7) 46(PB0) 47(PB1) 48(PB2-BOOT1(PB2)) 100(PA8) 123(PD7) 134(PB4(NJTRST)) 135(PB5)

### Buses and harness runs
harness port GPIO_1_8_in = sheet Designator/GPIO_1_8_in

### Layout directives
differential pair: Out_D_1_MB_N, Out_D_1_MB_P

### Notes on the sheet
- Подп. и дата
- Инв. № дубл.
- Взам. инв. №
- Инв. № подл.
- Изм.
- Лист
- № докум.
- Подп.
- Дата
- Форма 2а ГОСТ 2.104-2006
- Копировал
- Формат А3

### Library data of the parts
C1 C2 = Capacitor: Назначение: SMD-конденсатор; Наименование: Конденсатор; Потребление, Вт: 0; Value: 0,1мкФ
C3-C15 = Capacitor: Назначение: SMD-конденсатор; Наименование: Конденсатор; Потребление, Вт: 0; Value: 0,1мкФ
D1-D3 = LED: Назначение: Светодиод; Наименование: SMD-LED; Потребление, Вт: 0,01
GK1 = Crystal_Oscillator: Crystall oscillator, CMOS, 3.3V, SMD7050; Назначение: Кварцевый генератор; Потребление, Вт: 0,165; ComponentLink1Description: DataSheet; ComponentLink1URL: http://www.lit-phonon.ru/downloads/GK108-P.pdf
L1 = Inductor: Наименование: Индуктивность; Назначение: SMD-индуктивность; Потребление, Вт: 0,010; Value: 1мкГн
R1-R5 R7 R12 R15 R18-R26 R28 R29 = Resistor: Наименование: Резистор; Назначение: SMD-резистор; Потребление, Вт: 0,001; Value: 1к
R6 R8-R11 R13 R14 R16 R17 R27 = Resistor: Наименование: Резистор; Назначение: SMD-резистор; Потребление, Вт: 0,001; Value: 1к
U1 = STM32F405ZGT: ARM Cortex-M4 32-bit MCU+FPU, 210 DMIPS, 1024 kB Flash, 192 kB Internal RAM, 114 I/Os, 144-pin LQFP, -40 to 105 degC, Tray; Потребление, Вт: 0.2; Назначение: ARM Cortex-M4 32-bit MCU+FPU; ComponentLink1Description: Datasheet; ComponentLink1URL: http://www.st.com/st-web-ui/static/active/en/resource/technical/document/datasheet/DM00037051.pdf; DataSheet: https://www.st.com/content/ccc/resource/technical/document/reference_manual/3d/6d/5a/66/b4/99/40/d4/DM00031020.pdf/files/DM00031020.pdf/jcr:content/translations/en.DM00031020.pdf; HalManual: https://www.st.com/resource/en/user_manual/dm00105879-description-of-stm32f4-hal-and-ll-drivers-stmicroelectronics.pdf
X1 = EDGE 2X4: Потребление, Вт: 0; Назначение: Разъем для прошивки МК
X2 = SD-card holder: Назначение: Слот под SD-карту; Наименование: SD-card
X3 = PLD2-12: as X10 on sheet Module_main; Назначение: Header, 12-Pin, Dual row; Наименование: PLD2-12

## Sheet USB.SchDoc: =GlobalProjectName
size 209 x 297 mm; ApprovedBy: Утвердил; CheckedBy: Проверил; Author: Разработал; DocumentNumber: ЮМП.250. Э3; Revision: #2.2; SheetNumber: 4; SheetTotal: 9; PageSetup: Record=PageOptions|CenterHorizontal=True|CenterVertical=True|PrintScale=1.00|XCorrection=1.00|YCorrection=1.00|PrintKind=1|BorderSize=5000000|LeftOffset=0|BottomOffset=0|Orientation=2|PaperLength=1000|PaperWidth=1000|Scale=100|PaperSource=15|PrintQuality=1200|MediaType=1|DitherType=10|PaperKind=A3|PrintScaleMode=1; Weight: -; ScaleFactor: -; NormInspection: Норм.Контр.; FirstApplication: ЮМП.250.; DocumentName: OAI_KPA_MKU
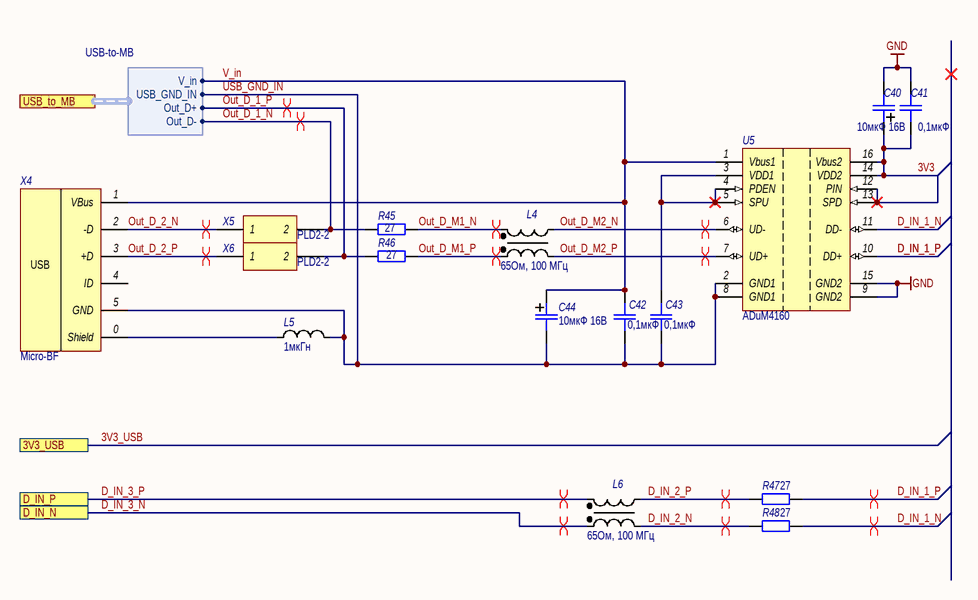
[diagram p2: USB.SchDoc]

### Parts
C40  10мкФ 16В  [SMD_size_B]
C41  0,1мкФ  [SMD_0805]
C42  0,1мкФ  [SMD_0805]
C43  0,1мкФ  [SMD_0805]
C44  10мкФ 16В  [SMD_size_B]
L4  65Ом, 100 МГц  [ACM2012]
L5  1мкГн  [SMD_0805]
L6  65Ом, 100 МГц  [ACM2012]
R45  27  [SMD_0805]
R46  27  [SMD_0805]
R47  27  [SMD_0805]
R48  27  [SMD_0805]
U5  ADuM1402  [SOIC-16-WIDE]  (value not drawn)
X4  Наименование: Micro-BF  [USB Micro-BF smd]  (hidden comment: mico-BF)
X5  Header 2X1  [PLD2-2]  (value not drawn)
X6  Header 2X1  [PLD2-2]  (value not drawn)

### Ports
3V3_USB, D_IN_N, D_IN_P, USB_to_MB (harness USB-to-MB)

### Harnesses
USB-to-MB: V_in, Out_D+, Out_D-, USB_GND_IN

### Nets
GND: C40.2 C41.1 U5.9(GND2) U5.15(GND2)
USB_GND_IN: C42.1 C43.1 C44.2 L5.2 U5.2(GND1) U5.8(GND1) X4.5(GND) ; port USB_to_MB.USB_GND_IN
3V3: C40.1 C41.2 U5.12(PIN) U5.13(SPD) U5.14(VDD2) U5.16(Vbus2)
D_IN_1_N: R48.2 U5.11(DD-)
D_IN_1_P: R47.2 U5.10(DD+)
D_IN_2_N: L6.1 R48.1
D_IN_2_P: L6.4 R47.1
D_IN_3_N: L6.2 ; port D_IN_N
D_IN_3_P: L6.3 ; port D_IN_P
Out_D_1_N: R45.1 X5.2 ; port USB_to_MB.Out_D-  [project net Out_D_1_MB_N]
Out_D_1_P: R46.1 X6.2 ; port USB_to_MB.Out_D+  [project net Out_D_1_MB_P]
Out_D_2_N: X4.2(-D) X5.1
Out_D_2_P: X4.3(+D) X6.1
Out_D_M1_N: L4.3 R45.2
Out_D_M1_P: L4.2 R46.2
Out_D_M2_N: L4.4 U5.6(UD-)
Out_D_M2_P: L4.1 U5.7(UD+)
V_in: C42.2 C44.1 U5.1(Vbus1) X4.1(VBus) ; port USB_to_MB.V_in
NetC43_2: C43.2 U5.3(VDD1) U5.4(PDEN) U5.5(SPU)
NetL5_1: L5.1 X4.0(Shield)

Not connected (* = marked no-connect by the designer): X4 4(ID)

### Layout directives
differential pair: D_IN_1_N, D_IN_1_P, D_IN_2_N, D_IN_2_P, D_IN_3_N, D_IN_3_P, Out_D_1_MB_N, Out_D_1_MB_P, Out_D_2_N, Out_D_2_P, Out_D_M1_N, Out_D_M1_P, Out_D_M2_N, Out_D_M2_P

### Notes on the sheet
- Подп. и дата
- Инв. № дубл.
- Взам. инв. №
- Инв. № подл.
- Изм.
- Лист
- № докум.
- Подп.
- Дата
- Форма 2а ГОСТ 2.104-2006
- Копировал
- Формат А4
- (in symbol MicroUSB) USB

### Library data of the parts
C40 C44 = Capacitor_pol: Polarized capacitor; Назначение: Поляризованный SMD-конденсатор; Наименование: Поляризованный конденсатор; Потребление, Вт: 0; Value: 10мкФх50В
C41-C43 = Capacitor: as C3 on sheet main; Value: 0,1мкФ
L4 L6 = Inductor_coupled: Coupled inductor; Назначение: Связанная индуктивность; Value: 20мкГн, 8,5мОм; Наименование: PLT10HH1026R0PN; Потребление, Вт: 0,1
L5 = Inductor: as L1 on sheet main; Value: 1мкГн
R45-R48 = Resistor: as R1 on sheet main
U5 = ADuM4160: Quad Channel Digital Isolator, 2.5 KV rms Insulation Rating; Назначение: цифровой изолятор шины USB; Потребление, Вт: 0,025; DataSheet: https://www.analog.com/media/en/technical-documentation/data-sheets/ADuM4160.pdf; Наименование: ADuM4160
X4 = MicroUSB: USB mico-BF; Назначение: Разъем на плату; Потребление, Вт: 0; DataSheet: *
X5 X6 = PLD2-2: Header, 2-Pin, Dual row; Потребление, Вт: 0,0; Назначение: Header, 2-Pin, Dual row; Наименование: PLD2-2

## Sheet adc.SchDoc: =GlobalProjectName
size 209 x 297 mm; ApprovedBy: Утвердил; CheckedBy: Проверил; Author: Разработал; DocumentNumber: ЮМП.250. Э3; Revision: #2.2; SheetNumber: 2; SheetTotal: 9; PageSetup: Record=PageOptions|CenterHorizontal=True|CenterVertical=True|PrintScale=1.00|XCorrection=1.00|YCorrection=1.00|PrintKind=1|BorderSize=5000000|LeftOffset=0|BottomOffset=0|Orientation=2|PaperLength=1000|PaperWidth=1000|Scale=100|PaperSource=15|PrintQuality=1200|MediaType=1|DitherType=10|PaperKind=A3|PrintScaleMode=1; Weight: -; ScaleFactor: -; NormInspection: Норм.Контр.; FirstApplication: ЮМП.250.; DocumentName: OAI_KPA_MKU
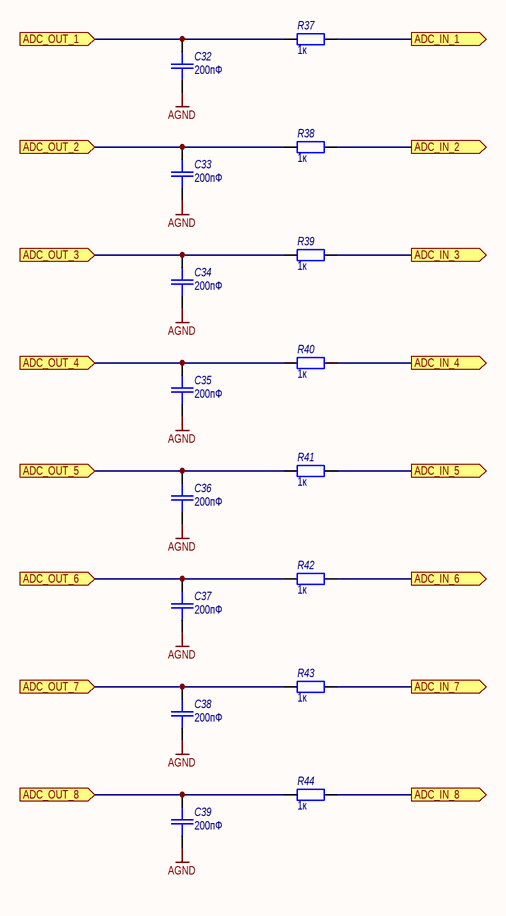
[diagram p3: adc.SchDoc]

### Parts
C32  200пФ  [SMD_0805]
C33  200пФ  [SMD_0805]
C34  200пФ  [SMD_0805]
C35  200пФ  [SMD_0805]
C36  200пФ  [SMD_0805]
C37  200пФ  [SMD_0805]
C38  200пФ  [SMD_0805]
C39  200пФ  [SMD_0805]
R37  1к  [SMD_0805]
R38  1к  [SMD_0805]
R39  1к  [SMD_0805]
R40  1к  [SMD_0805]
R41  1к  [SMD_0805]
R42  1к  [SMD_0805]
R43  1к  [SMD_0805]
R44  1к  [SMD_0805]

### Ports
ADC_IN_1 (out), ADC_IN_2 (out), ADC_IN_3 (out), ADC_IN_4 (out), ADC_IN_5 (out), ADC_IN_6 (out), ADC_IN_7 (out), ADC_IN_8 (out), ADC_OUT_1 (in), ADC_OUT_2 (in), ADC_OUT_3 (in), ADC_OUT_4 (in), ADC_OUT_5 (in), ADC_OUT_6 (in), ADC_OUT_7 (in), ADC_OUT_8 (in)

### Nets
AGND: C32.1 C33.1 C34.1 C35.1 C36.1 C37.1 C38.1 C39.1  [project net A_GND]
ADC_IN_1: R37.2 ; port ADC_IN_1
ADC_IN_2: R38.2 ; port ADC_IN_2
ADC_IN_3: R39.2 ; port ADC_IN_3
ADC_IN_4: R40.2 ; port ADC_IN_4
ADC_IN_5: R41.2 ; port ADC_IN_5
ADC_IN_6: R42.2 ; port ADC_IN_6
ADC_IN_7: R43.2 ; port ADC_IN_7
ADC_IN_8: R44.2 ; port ADC_IN_8
ADC_MC_IN_1: C32.2 R37.1 ; port ADC_OUT_1
ADC_MC_IN_2: C33.2 R38.1 ; port ADC_OUT_2
ADC_MC_IN_3: C34.2 R39.1 ; port ADC_OUT_3
ADC_MC_IN_4: C35.2 R40.1 ; port ADC_OUT_4
ADC_MC_IN_5: C36.2 R41.1 ; port ADC_OUT_5
ADC_MC_IN_6: C37.2 R42.1 ; port ADC_OUT_6
ADC_MC_IN_7: C38.2 R43.1 ; port ADC_OUT_7
ADC_MC_IN_8: C39.2 R44.1 ; port ADC_OUT_8

### Notes on the sheet
- Подп. и дата
- Инв. № дубл.
- Взам. инв. №
- Инв. № подл.
- Изм.
- Лист
- № докум.
- Подп.
- Дата
- Форма 2а ГОСТ 2.104-2006
- Копировал
- Формат А4

### Library data of the parts
C32-C39 = Capacitor: as C1 on sheet main
R37-R44 = Resistor: as R6 on sheet main; Value: 1к

## Sheet dac.SchDoc: =GlobalProjectName
size 209 x 297 mm; ApprovedBy: Утвердил; CheckedBy: Проверил; Author: Разработал; DocumentNumber: ЮМП.250. Э3; Revision: #2.2; SheetNumber: 6; SheetTotal: 9; PageSetup: Record=PageOptions|CenterHorizontal=True|CenterVertical=True|PrintScale=1.00|XCorrection=1.00|YCorrection=1.00|PrintKind=1|BorderSize=5000000|LeftOffset=0|BottomOffset=0|Orientation=2|PaperLength=1000|PaperWidth=1000|Scale=100|PaperSource=15|PrintQuality=1200|MediaType=1|DitherType=10|PaperKind=A3|PrintScaleMode=1; Weight: -; ScaleFactor: -; NormInspection: Норм.Контр.; FirstApplication: ЮМП.250.; DocumentName: OAI_KPA_MKU
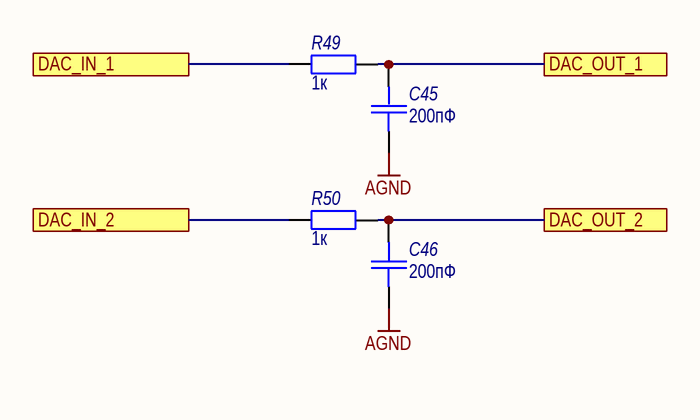
[diagram p4: dac.SchDoc]

### Parts
C45  200пФ  [SMD_0805]
C46  200пФ  [SMD_0805]
R49  1к  [SMD_0603]
R50  1к  [SMD_0603]

### Ports
DAC_IN_1, DAC_IN_2, DAC_OUT_1, DAC_OUT_2

### Nets
AGND: C45.1 C46.1  [project net A_GND]
DAC_MC_Out_1: R49.1 ; port DAC_IN_1
DAC_MC_Out_2: R50.1 ; port DAC_IN_2
DAC_OUT_1: C45.2 R49.2 ; port DAC_OUT_1
DAC_OUT_2: C46.2 R50.2 ; port DAC_OUT_2

### Notes on the sheet
- Подп. и дата
- Инв. № дубл.
- Взам. инв. №
- Инв. № подл.
- Изм.
- Лист
- № докум.
- Подп.
- Дата
- Форма 2а ГОСТ 2.104-2006
- Копировал
- Формат А4

### Library data of the parts
C45 C46 = Capacitor: as C1 on sheet main
R49 R50 = Resistor: as R6 on sheet main; Value: 1к

## Sheet GPIO_Shunt.SchDoc: =GlobalProjectName
size 209 x 297 mm; ApprovedBy: Утвердил; CheckedBy: Проверил; Author: Разработал; DocumentNumber: ЮМП.250. Э3; Revision: #2.2; SheetNumber: 5; SheetTotal: 9; PageSetup: Record=PageOptions|CenterHorizontal=True|CenterVertical=True|PrintScale=1.00|XCorrection=1.00|YCorrection=1.00|PrintKind=1|BorderSize=5000000|LeftOffset=0|BottomOffset=0|Orientation=2|PaperLength=1000|PaperWidth=1000|Scale=100|PaperSource=15|PrintQuality=1200|MediaType=1|DitherType=10|PaperKind=A3|PrintScaleMode=1; Weight: -; ScaleFactor: -; NormInspection: Норм.Контр.; FirstApplication: ЮМП.250.; DocumentName: OAI_KPA_MKU
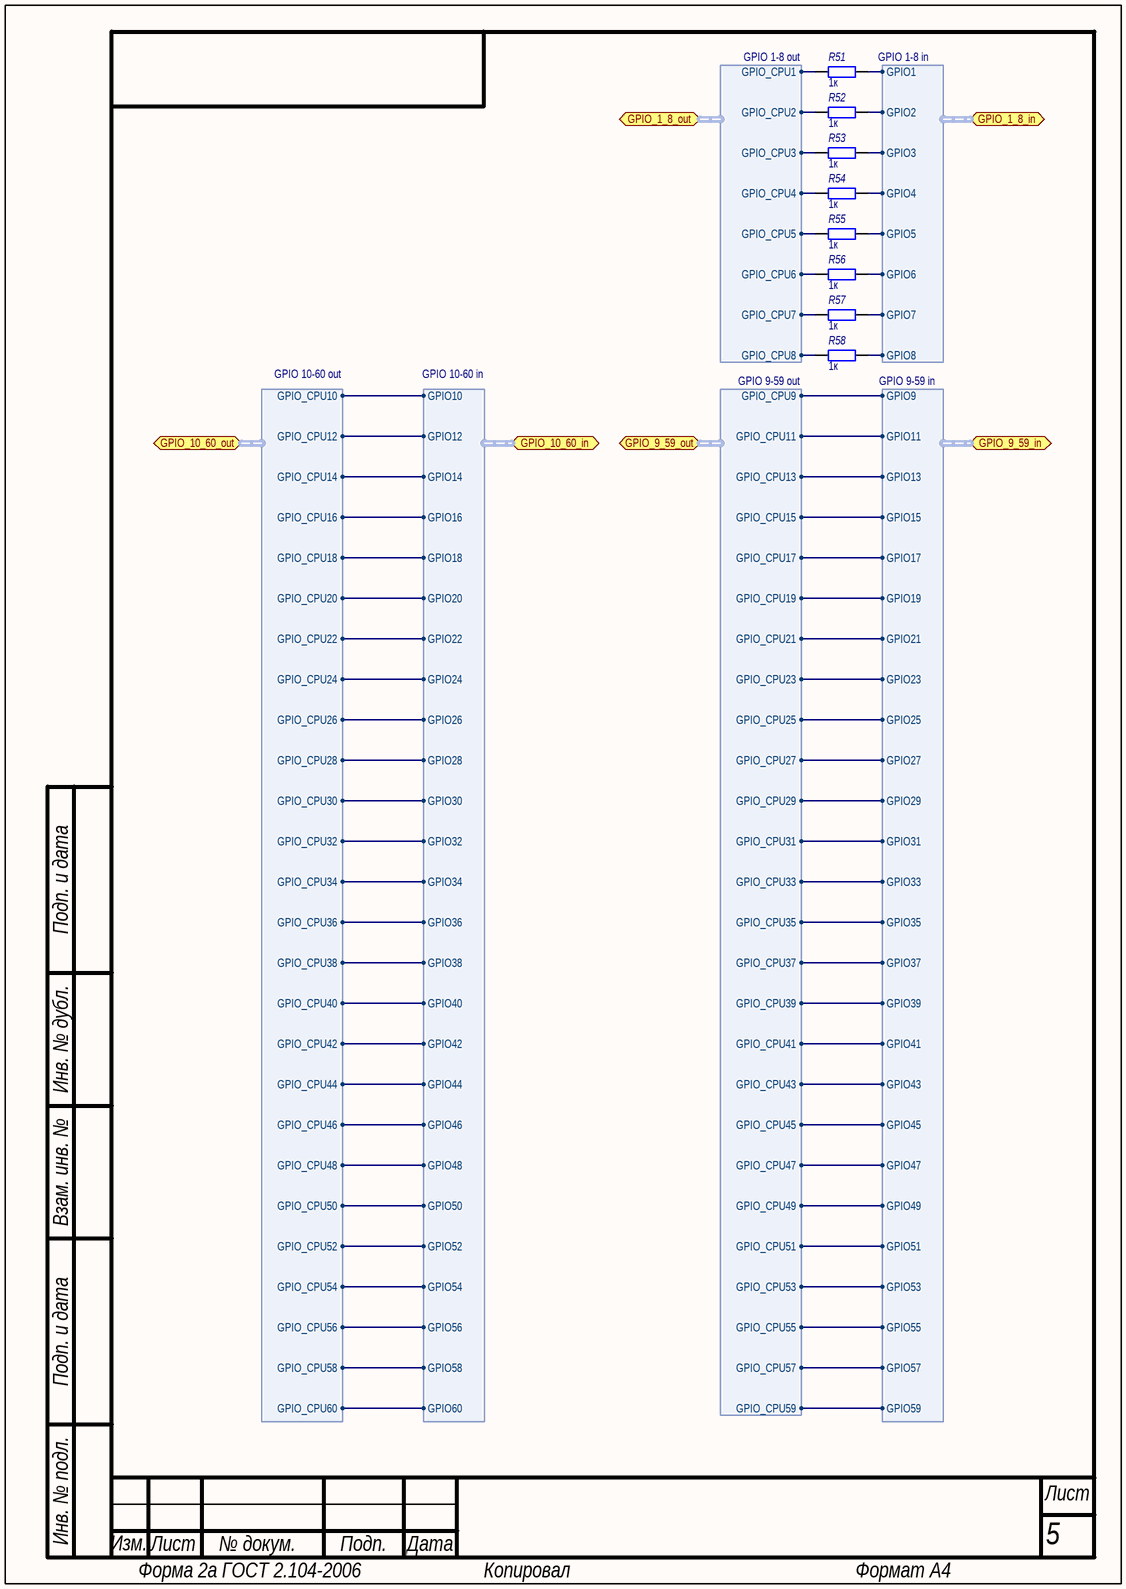
[diagram p5: GPIO_Shunt.SchDoc]

### Parts
R51  1к  [SMD_0603]
R52  1к  [SMD_0603]
R53  1к  [SMD_0603]
R54  1к  [SMD_0603]
R55  1к  [SMD_0603]
R56  1к  [SMD_0603]
R57  1к  [SMD_0603]
R58  1к  [SMD_0603]

### Ports
GPIO_1_8_in (bidir, harness GPIO 1-8 in), GPIO_1_8_out (bidir, harness GPIO 1-8 out), GPIO_9_59_in (bidir, harness GPIO 9-59 in), GPIO_9_59_out (bidir, harness GPIO 9-59 out), GPIO_10_60_in (bidir, harness GPIO 10-60 in), GPIO_10_60_out (bidir, harness GPIO 10-60 out)

### Harnesses
GPIO 1-8 in: GPIO1, GPIO2, GPIO3, GPIO4, GPIO5, GPIO6, GPIO7, GPIO8
GPIO 1-8 out: GPIO_CPU2, GPIO_CPU3, GPIO_CPU4, GPIO_CPU5, GPIO_CPU6, GPIO_CPU7, GPIO_CPU8, GPIO_CPU1
GPIO 9-59 in: GPIO11, GPIO13, GPIO15, GPIO17, GPIO19, GPIO21, GPIO23, GPIO25, GPIO27, GPIO29, GPIO31, GPIO33, GPIO35, GPIO37, GPIO39, GPIO41, GPIO43, GPIO45, GPIO47, GPIO49, GPIO51, GPIO53, GPIO55, GPIO57, GPIO59, GPIO9
GPIO 9-59 out: GPIO_CPU11, GPIO_CPU9, GPIO_CPU13, GPIO_CPU15, GPIO_CPU17, GPIO_CPU19, GPIO_CPU21, GPIO_CPU23, GPIO_CPU25, GPIO_CPU27, GPIO_CPU29, GPIO_CPU31, GPIO_CPU33, GPIO_CPU35, GPIO_CPU37, GPIO_CPU39, GPIO_CPU41, GPIO_CPU43, GPIO_CPU45, GPIO_CPU47, GPIO_CPU49, GPIO_CPU51, GPIO_CPU53, GPIO_CPU55, GPIO_CPU57, GPIO_CPU59
GPIO 10-60 in: GPIO10, GPIO12, GPIO14, GPIO16, GPIO18, GPIO20, GPIO22, GPIO24, GPIO26, GPIO28, GPIO30, GPIO32, GPIO34, GPIO36, GPIO38, GPIO40, GPIO42, GPIO44, GPIO46, GPIO48, GPIO50, GPIO52, GPIO54, GPIO56, GPIO58, GPIO60
GPIO 10-60 out: GPIO_CPU12, GPIO_CPU10, GPIO_CPU14, GPIO_CPU16, GPIO_CPU18, GPIO_CPU20, GPIO_CPU22, GPIO_CPU24, GPIO_CPU26, GPIO_CPU28, GPIO_CPU30, GPIO_CPU32, GPIO_CPU34, GPIO_CPU36, GPIO_CPU38, GPIO_CPU40, GPIO_CPU42, GPIO_CPU44, GPIO_CPU46, GPIO_CPU48, GPIO_CPU50, GPIO_CPU52, GPIO_CPU54, GPIO_CPU56, GPIO_CPU58, GPIO_CPU60

### Nets
GPIO_1: R51.2 ; port GPIO_1_8_in.GPIO1
GPIO_2: R52.2 ; port GPIO_1_8_in.GPIO2
GPIO_3: R53.2 ; port GPIO_1_8_in.GPIO3
GPIO_4: R54.2 ; port GPIO_1_8_in.GPIO4
GPIO_5: R55.2 ; port GPIO_1_8_in.GPIO5
GPIO_6: R56.2 ; port GPIO_1_8_in.GPIO6
GPIO_7: R57.2 ; port GPIO_1_8_in.GPIO7
GPIO_8: R58.2 ; port GPIO_1_8_in.GPIO8
GPIO_9: port GPIO_9_59_in.GPIO9, port GPIO_9_59_out.GPIO_CPU9
GPIO_10: port GPIO_10_60_in.GPIO10, port GPIO_10_60_out.GPIO_CPU10
GPIO_11: port GPIO_9_59_in.GPIO11, port GPIO_9_59_out.GPIO_CPU11
GPIO_12: port GPIO_10_60_in.GPIO12, port GPIO_10_60_out.GPIO_CPU12
GPIO_13: port GPIO_9_59_in.GPIO13, port GPIO_9_59_out.GPIO_CPU13
GPIO_14: port GPIO_10_60_in.GPIO14, port GPIO_10_60_out.GPIO_CPU14
GPIO_15: port GPIO_9_59_in.GPIO15, port GPIO_9_59_out.GPIO_CPU15
GPIO_16: port GPIO_10_60_in.GPIO16, port GPIO_10_60_out.GPIO_CPU16
GPIO_17: port GPIO_9_59_in.GPIO17, port GPIO_9_59_out.GPIO_CPU17
GPIO_18: port GPIO_10_60_in.GPIO18, port GPIO_10_60_out.GPIO_CPU18
GPIO_19: port GPIO_9_59_in.GPIO19, port GPIO_9_59_out.GPIO_CPU19
GPIO_20: port GPIO_10_60_in.GPIO20, port GPIO_10_60_out.GPIO_CPU20
GPIO_21: port GPIO_9_59_in.GPIO21, port GPIO_9_59_out.GPIO_CPU21
GPIO_22: port GPIO_10_60_in.GPIO22, port GPIO_10_60_out.GPIO_CPU22
GPIO_23: port GPIO_9_59_in.GPIO23, port GPIO_9_59_out.GPIO_CPU23
GPIO_24: port GPIO_10_60_in.GPIO24, port GPIO_10_60_out.GPIO_CPU24
GPIO_25: port GPIO_9_59_in.GPIO25, port GPIO_9_59_out.GPIO_CPU25
GPIO_26: port GPIO_10_60_in.GPIO26, port GPIO_10_60_out.GPIO_CPU26
GPIO_27: port GPIO_9_59_in.GPIO27, port GPIO_9_59_out.GPIO_CPU27
GPIO_28: port GPIO_10_60_in.GPIO28, port GPIO_10_60_out.GPIO_CPU28
GPIO_29: port GPIO_9_59_in.GPIO29, port GPIO_9_59_out.GPIO_CPU29
GPIO_30: port GPIO_10_60_in.GPIO30, port GPIO_10_60_out.GPIO_CPU30
GPIO_31: port GPIO_9_59_in.GPIO31, port GPIO_9_59_out.GPIO_CPU31
GPIO_32: port GPIO_10_60_in.GPIO32, port GPIO_10_60_out.GPIO_CPU32
GPIO_33: port GPIO_9_59_in.GPIO33, port GPIO_9_59_out.GPIO_CPU33
GPIO_34: port GPIO_10_60_in.GPIO34, port GPIO_10_60_out.GPIO_CPU34
GPIO_35: port GPIO_9_59_in.GPIO35, port GPIO_9_59_out.GPIO_CPU35
GPIO_36: port GPIO_10_60_in.GPIO36, port GPIO_10_60_out.GPIO_CPU36
GPIO_37: port GPIO_9_59_in.GPIO37, port GPIO_9_59_out.GPIO_CPU37
GPIO_38: port GPIO_10_60_in.GPIO38, port GPIO_10_60_out.GPIO_CPU38
GPIO_39: port GPIO_9_59_in.GPIO39, port GPIO_9_59_out.GPIO_CPU39
GPIO_40: port GPIO_10_60_in.GPIO40, port GPIO_10_60_out.GPIO_CPU40
GPIO_41: port GPIO_9_59_in.GPIO41, port GPIO_9_59_out.GPIO_CPU41
GPIO_42: port GPIO_10_60_in.GPIO42, port GPIO_10_60_out.GPIO_CPU42
GPIO_43: port GPIO_9_59_in.GPIO43, port GPIO_9_59_out.GPIO_CPU43
GPIO_44: port GPIO_10_60_in.GPIO44, port GPIO_10_60_out.GPIO_CPU44
GPIO_45: port GPIO_9_59_in.GPIO45, port GPIO_9_59_out.GPIO_CPU45
GPIO_46: port GPIO_10_60_in.GPIO46, port GPIO_10_60_out.GPIO_CPU46
GPIO_47: port GPIO_9_59_in.GPIO47, port GPIO_9_59_out.GPIO_CPU47
GPIO_48: port GPIO_10_60_in.GPIO48, port GPIO_10_60_out.GPIO_CPU48
GPIO_49: port GPIO_9_59_in.GPIO49, port GPIO_9_59_out.GPIO_CPU49
GPIO_50: port GPIO_10_60_in.GPIO50, port GPIO_10_60_out.GPIO_CPU50
GPIO_51: port GPIO_9_59_in.GPIO51, port GPIO_9_59_out.GPIO_CPU51
GPIO_52: port GPIO_10_60_in.GPIO52, port GPIO_10_60_out.GPIO_CPU52
GPIO_53: port GPIO_9_59_in.GPIO53, port GPIO_9_59_out.GPIO_CPU53
GPIO_54: port GPIO_10_60_in.GPIO54, port GPIO_10_60_out.GPIO_CPU54
GPIO_55: port GPIO_9_59_in.GPIO55, port GPIO_9_59_out.GPIO_CPU55
GPIO_56: port GPIO_10_60_in.GPIO56, port GPIO_10_60_out.GPIO_CPU56
GPIO_57: port GPIO_9_59_in.GPIO57, port GPIO_9_59_out.GPIO_CPU57
GPIO_58: port GPIO_10_60_in.GPIO58, port GPIO_10_60_out.GPIO_CPU58
GPIO_59: port GPIO_9_59_in.GPIO59, port GPIO_9_59_out.GPIO_CPU59
GPIO_60: port GPIO_10_60_in.GPIO60, port GPIO_10_60_out.GPIO_CPU60
GPIO_CPU_1: R51.1 ; port GPIO_1_8_out.GPIO_CPU1
GPIO_CPU_2: R52.1 ; port GPIO_1_8_out.GPIO_CPU2
GPIO_CPU_3: R53.1 ; port GPIO_1_8_out.GPIO_CPU3
GPIO_CPU_4: R54.1 ; port GPIO_1_8_out.GPIO_CPU4
GPIO_CPU_5: R55.1 ; port GPIO_1_8_out.GPIO_CPU5
GPIO_CPU_6: R56.1 ; port GPIO_1_8_out.GPIO_CPU6
GPIO_CPU_7: R57.1 ; port GPIO_1_8_out.GPIO_CPU7
GPIO_CPU_8: R58.1 ; port GPIO_1_8_out.GPIO_CPU8

### Notes on the sheet
- Подп. и дата
- Инв. № дубл.
- Взам. инв. №
- Инв. № подл.
- Изм.
- Лист
- № докум.
- Подп.
- Дата
- Форма 2а ГОСТ 2.104-2006
- Копировал
- Формат А4

### Library data of the parts
R51-R58 = Resistor: as R6 on sheet main; Value: 1к

## Sheet power.SchDoc: =GlobalProjectName
size 209 x 297 mm; ApprovedBy: Утвердил; CheckedBy: Проверил; Author: Разработал; DocumentNumber: ЮМП.250. Э3; Revision: #2.2; SheetNumber: 1; SheetTotal: 9; PageSetup: Record=PageOptions|CenterHorizontal=True|CenterVertical=True|PrintScale=1.00|XCorrection=1.00|YCorrection=1.00|PrintKind=1|BorderSize=5000000|LeftOffset=0|BottomOffset=0|Orientation=2|PaperLength=1000|PaperWidth=1000|Scale=100|PaperSource=15|PrintQuality=1200|MediaType=1|DitherType=10|PaperKind=A3|PrintScaleMode=1; Weight: -; ScaleFactor: -; NormInspection: Норм.Контр.; FirstApplication: ЮМП.250.; DocumentName: OAI_KPA_MKU
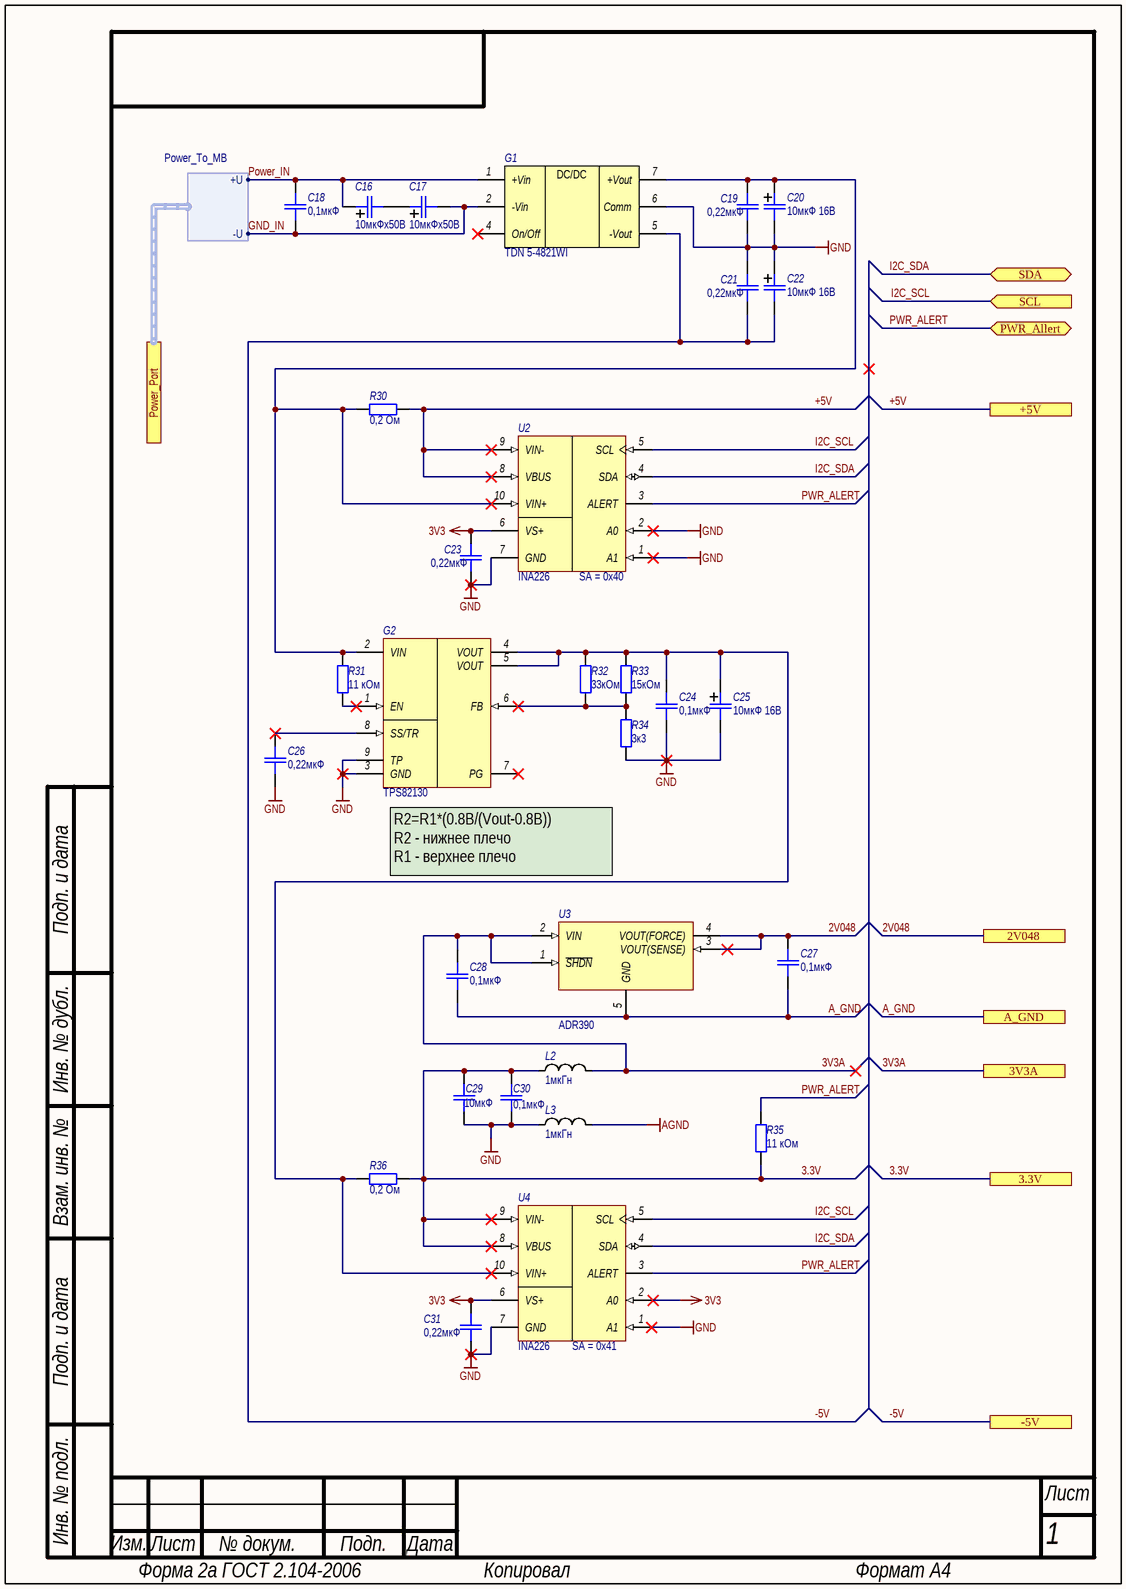
[diagram p6: power.SchDoc]

### Parts
C16  10мкФх50В  [SMD_size_C]
C17  10мкФх50В  [SMD_size_C]
C18  0,1мкФ  [SMD_0805]
C19  0,22мкФ  [SMD_0805]
C20  10мкФ 16В  [SMD_size_B]
C21  0,22мкФ  [SMD_0805]
C22  10мкФ 16В  [SMD_size_B]
C23  0,22мкФ  [SMD_0805]
C24  0,1мкФ  [SMD_0805]
C25  10мкФ 16В  [SMD_size_B]
C26  0,22мкФ  [SMD_0805]
C27  0,1мкФ  [SMD_0805]
C28  0,1мкФ  [SMD_0805]
C29  10мкФ  [SMD_0805]
C30  0,1мкФ  [SMD_0805]
C31  0,22мкФ  [SMD_0805]
G1  Наименование: TDN 5-4821WI  [TDN_5_WISM]  (hidden comment: TDN 5-4821)
G2  TPS82130  [uSiL-8]
L2  1мкГн  [SMD_0805]
L3  1мкГн  [SMD_0805]
R30  0,2 Ом  [SMD_0805]
R31  11 кОм  [SMD_0805]
R32  33кОм  [SMD_0805]
R33  15кОм  [SMD_0805]
R34  3к3  [SMD_0805]
R35  11 кОм  [SMD_0805]
R36  0,2 Ом  [SMD_0805]
U2  INA261  [VSSOP-10]  (value not drawn)
U3  ADR390  [TSOT-5]
U4  INA261  [VSSOP-10]  (value not drawn)

### Ports
2V048, 3.3V, 3V3A, +5V, -5V, A_GND, Power_Port (harness Power_To_MB), PWR_Allert (bidir), SCL (in), SDA (bidir)

### Harnesses
Power_To_MB: +U, -U

### Nets
2V048: C27.2 U3.3(VOUT(SENSE)) U3.4(VOUT(FORCE)) ; port 2V048
3.3V: C23.2 C29.2 C30.2 C31.2 L2.1 R35.1 R36.2 U2.6(VS+) U4.2(A0) U4.6(VS+) U4.8(VBUS) U4.9(VIN-) ; port 3.3V  [also labelled 3V3]
3V3A: C28.2 L2.2 U3.1(~{SHDN}) U3.2(VIN) ; port 3V3A
+5V: R30.2 U2.8(VBUS) U2.9(VIN-) ; port +5V
-5V: C21.1 C22.2 G1.5(-Vout) ; port -5V
A_GND: C27.1 C28.1 L3.2 U3.5(GND) ; port A_GND  [also labelled AGND]
GND: C19.1 C20.2 C21.2 C22.1 C23.1 C24.1 C25.2 C26.1 C29.1 C30.1 C31.1 G1.6(Comm) G2.3(GND) G2.9(TP) L3.1 R34.1 U2.1(A1) U2.2(A0) U2.7(GND) U4.1(A1) U4.7(GND)
GND_IN: C17.2 C18.1 G1.2(-Vin) ; port Power_Port.-U
Power_IN: C16.1 C18.2 G1.1(+Vin) ; port Power_Port.+U
I2C_SCL: U2.5(SCL) U4.5(SCL) ; port SCL
I2C_SDA: U2.4(SDA) U4.4(SDA) ; port SDA
PWR_ALERT: R35.2 U2.3(ALERT) U4.3(ALERT) ; port PWR_Allert
NetC16_2: C16.2 C17.1
NetC19_2: C19.2 C20.1 G1.7(+Vout) G2.2(VIN) R30.1 R31.2 U2.10(VIN+)
NetC24_2: C24.2 C25.1 G2.4(VOUT) G2.5(VOUT) R32.2 R33.2 R36.1 U4.10(VIN+)
NetC26_2: C26.2 G2.8(SS/TR)
NetG2_1: G2.1(EN) R31.1
NetG2_6: G2.6(FB) R32.1 R33.1 R34.2

Not connected (* = marked no-connect by the designer): G1 4(On/Off)*; G2 7(PG)*

### Notes on the sheet
- (near U2) SA = 0x40
- (near G2) R2=R1*(0.8В/(Vout-0.8B))
  R2 - нижнее плечо
  R1 - верхнее плечо
- (near U4) SA = 0x41
- Подп. и дата
- Инв. № дубл.
- Взам. инв. №
- Инв. № подл.
- Изм.
- Лист
- № докум.
- Подп.
- Дата
- Форма 2а ГОСТ 2.104-2006
- Копировал
- Формат А4
- (in symbol TDN_5) DC/DC

### Library data of the parts
C16 C17 = Capacitor_pol: Polarized capacitor; Назначение: Поляризованный SMD-конденсатор; Наименование: Поляризованный конденсатор; Потребление, Вт: 0; Value: 10мкФх50В
C18 C24 C27 C28 C30 = Capacitor: as C3 on sheet main; Value: 0,1мкФ
C19 C21 C23 C26 C29 C31 = Capacitor: as C1 on sheet main
C20 C22 C25 = Capacitor_pol: as C40 on sheet USB
G1 = TDN_5: DC/DC converter; Назначение: DC-DC преобразователь; Потребление, Вт: 0,01; DataSheet: https://www.tracopower.com/sites/default/files/products/datasheets/tdn5wi_datasheet.pdf
G2 = TPS82130: 17-V Input 3-A Step-Down Converter MicroSiP™ Module with Integrated Inductor; Потребление, Вт: 1,0; ComponentLink1Description: Data sheet; ComponentLink1URL: http://www.ti.com/lit/ds/symlink/tps82130.pdf; Назначение: 17-V Input 3-A Step-Down Converter MicroSiP™ Module with Integrated Inductor; DataSheet: https://www.ti.com/lit/ds/symlink/tps82130.pdf?ts=1592813288219&ref_url=https%253A%252F%252Fwww.google.com%252F; Наименование: TPS82130
L2 L3 = Inductor: as L1 on sheet main; Value: 1мкГн
R30-R36 = Resistor: as R1 on sheet main
U2 U4 = INA226: High- or Low-Side Measurement, Bidirectional Current and Power Monitor With I2C Interface; Назначение: High-Side or Low-Side Measurement,; Потребление, Вт: 0,001; ComponentLink1Description: Data sheet; ComponentLink1URL: http://www.ti.com/lit/ds/symlink/ina226.pdf; DataSheet: https://www.ti.com/lit/ds/symlink/ina226.pdf?ts=1592809211957&ref_url=https%253A%252F%252Fwww.google.com%252F; Наименование: INA226
U3 = ADR390: Micropower, Low Noise Precision Voltage Reference with Shutdown, 2.5 V Output, 2.8 to 15 V Supply, Industrial, 5-pin SOT23 (UJ-5), Reel; Потребление, Вт: 0,001; Назначение: Источник опорного напряжения; Наименование: ADR390; DataSheet: https://www.analog.com/media/en/technical-documentation/data-sheets/ADR390.pdf